# EAGLE schematic max10adc_v9.02_16chan (EAGLE 9.5.2)

## Sheet 1 of 3: Front-End
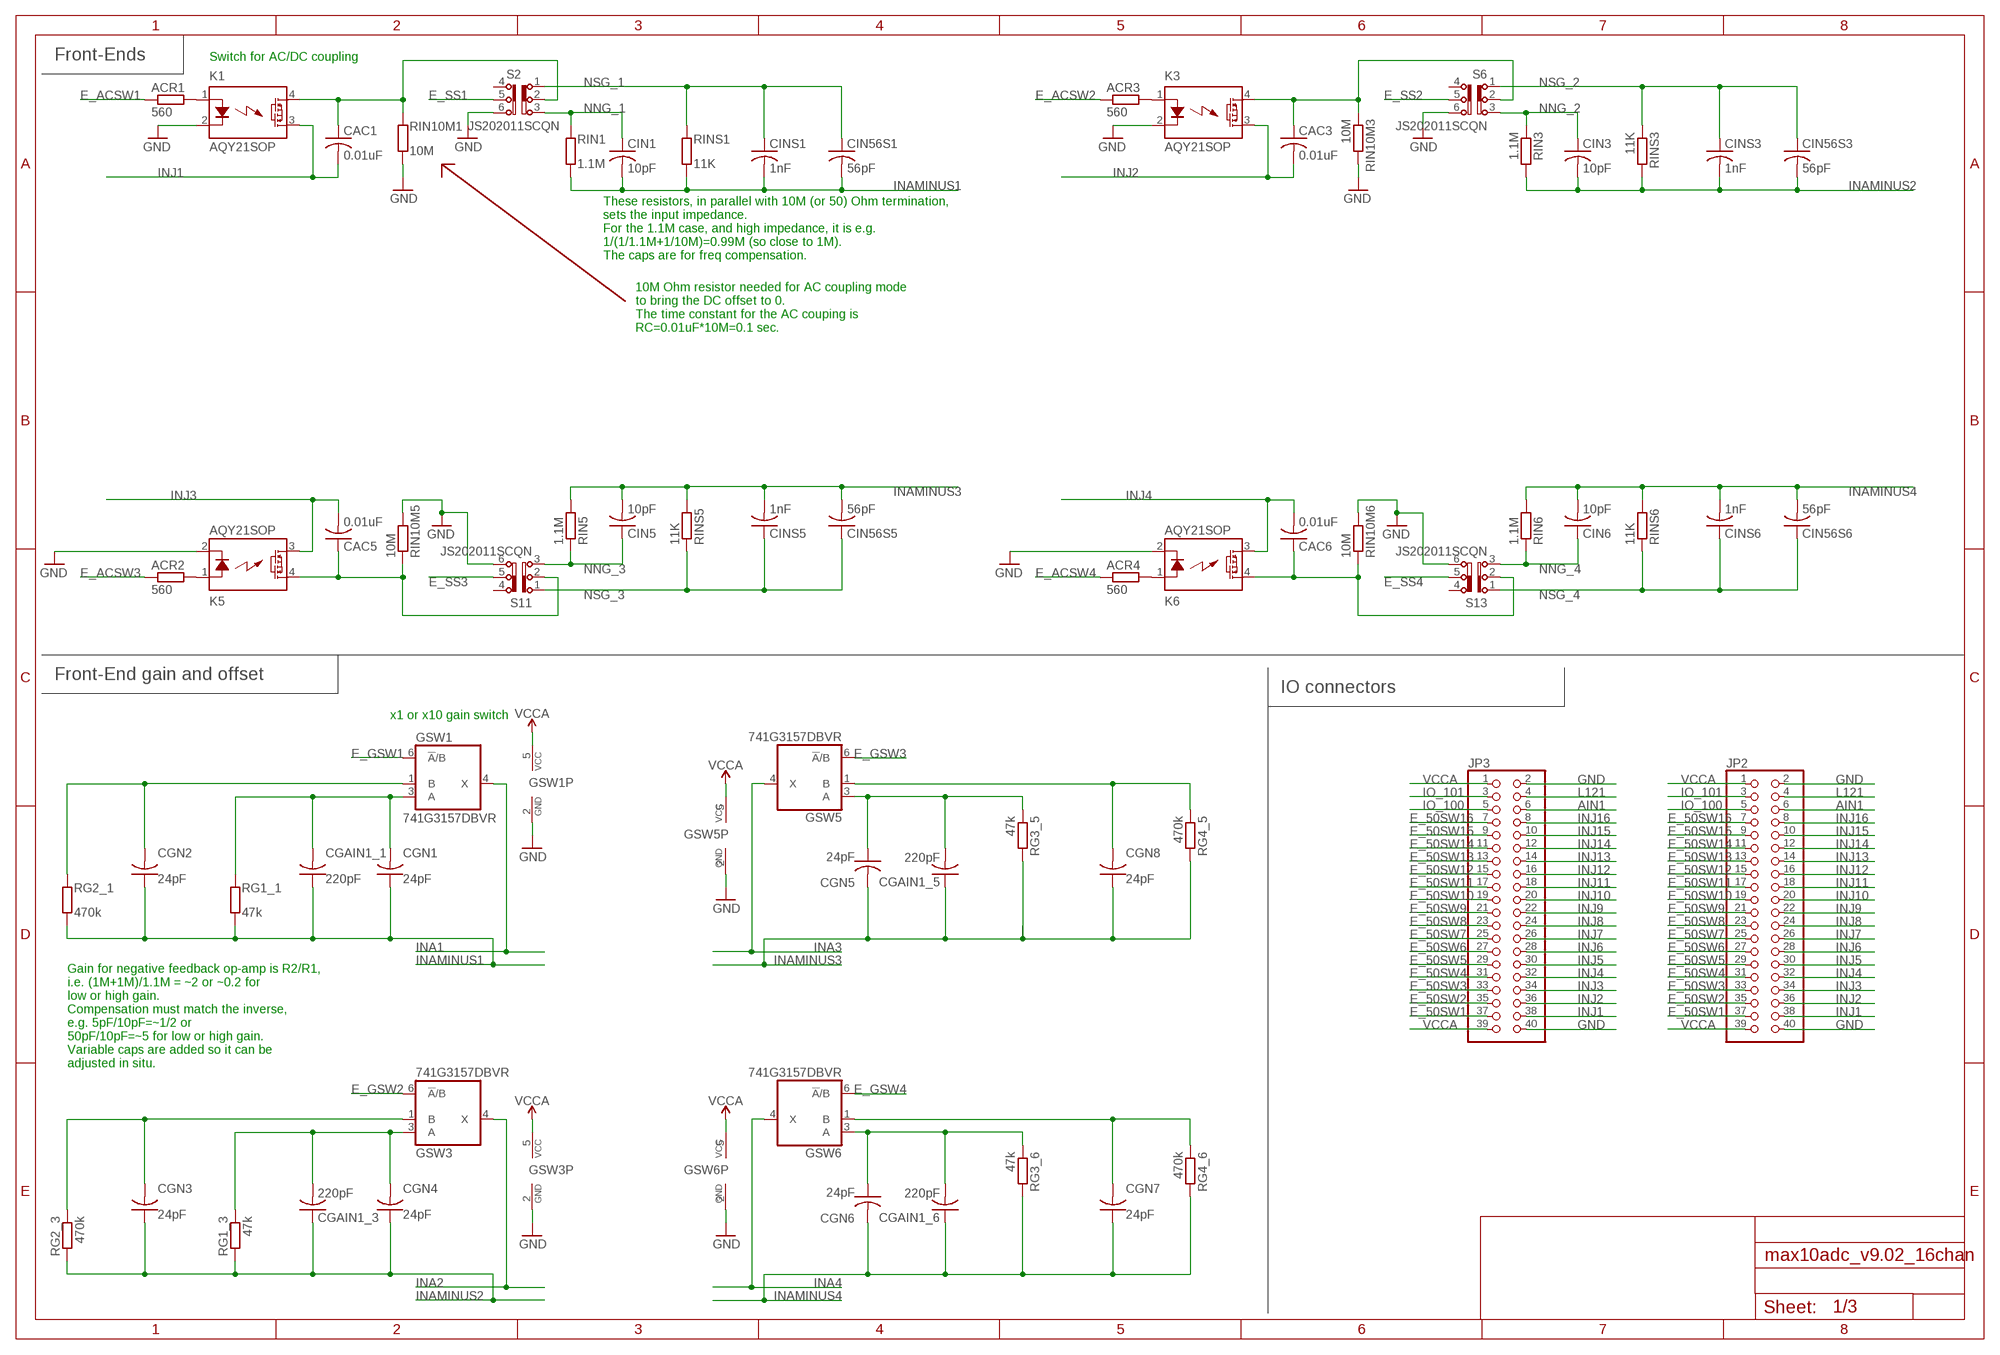
[diagram p0: schematic, sheet 1, part 1 of 3]
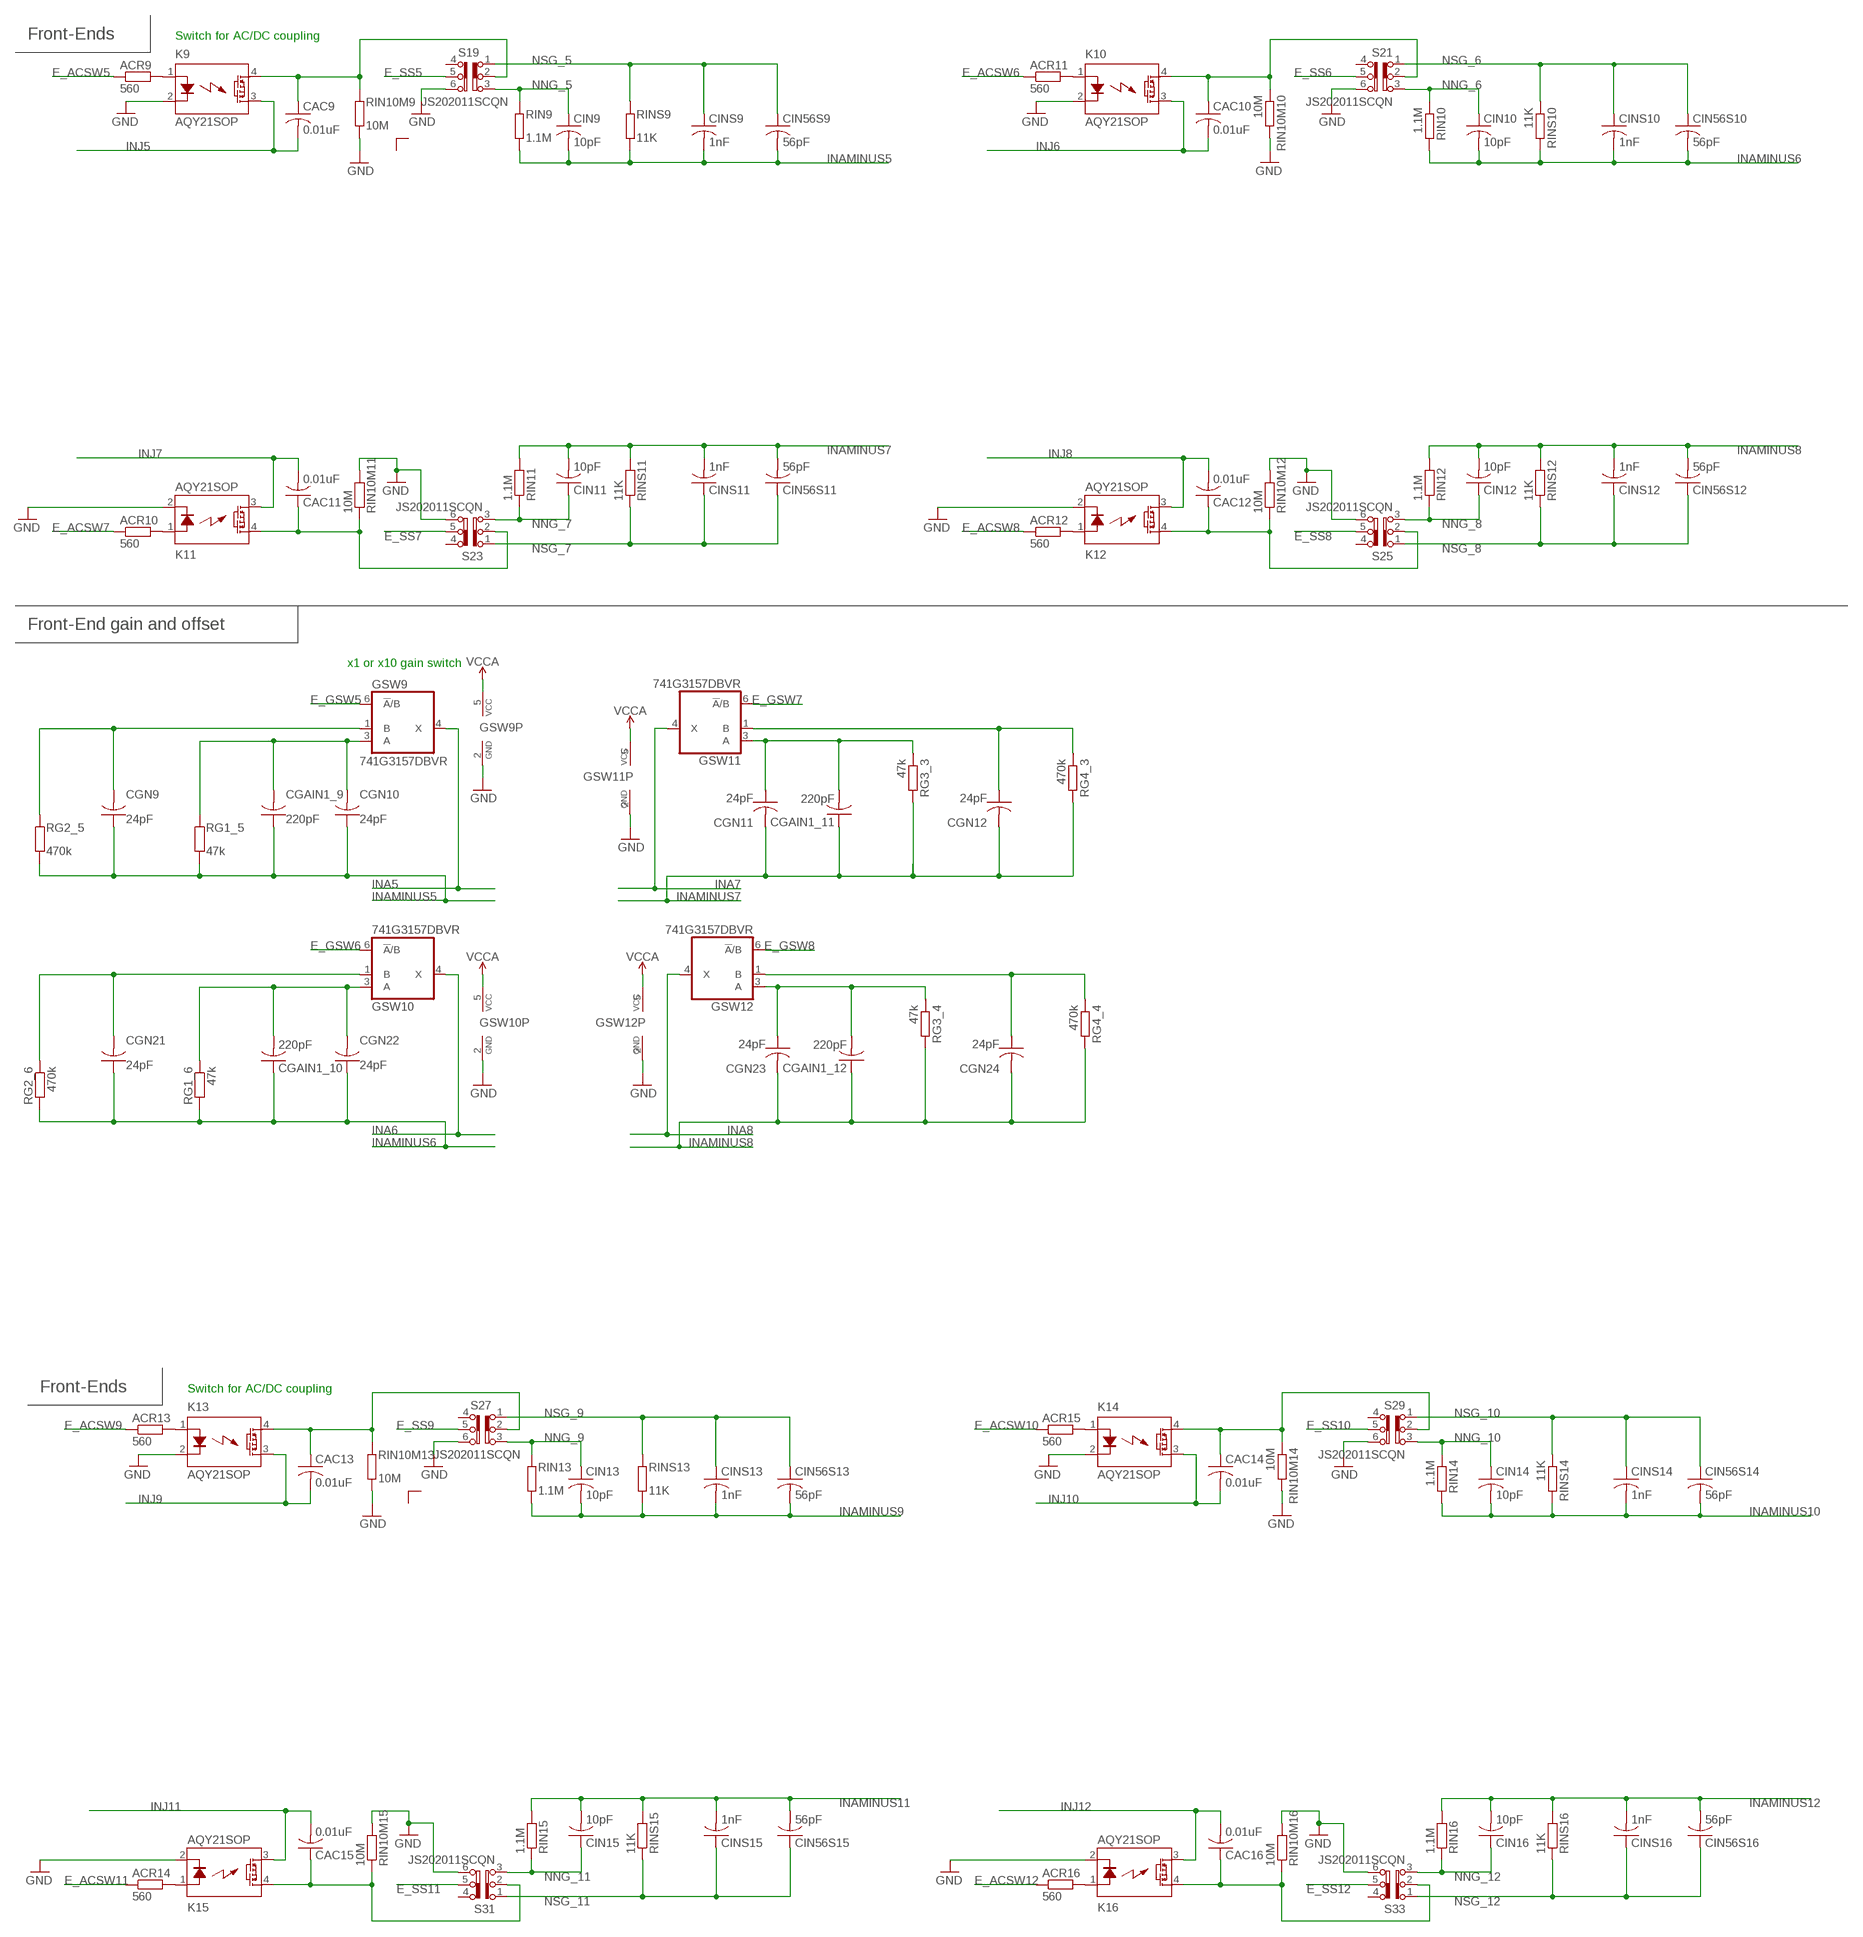
[diagram p1: schematic, sheet 1, part 2 of 3]
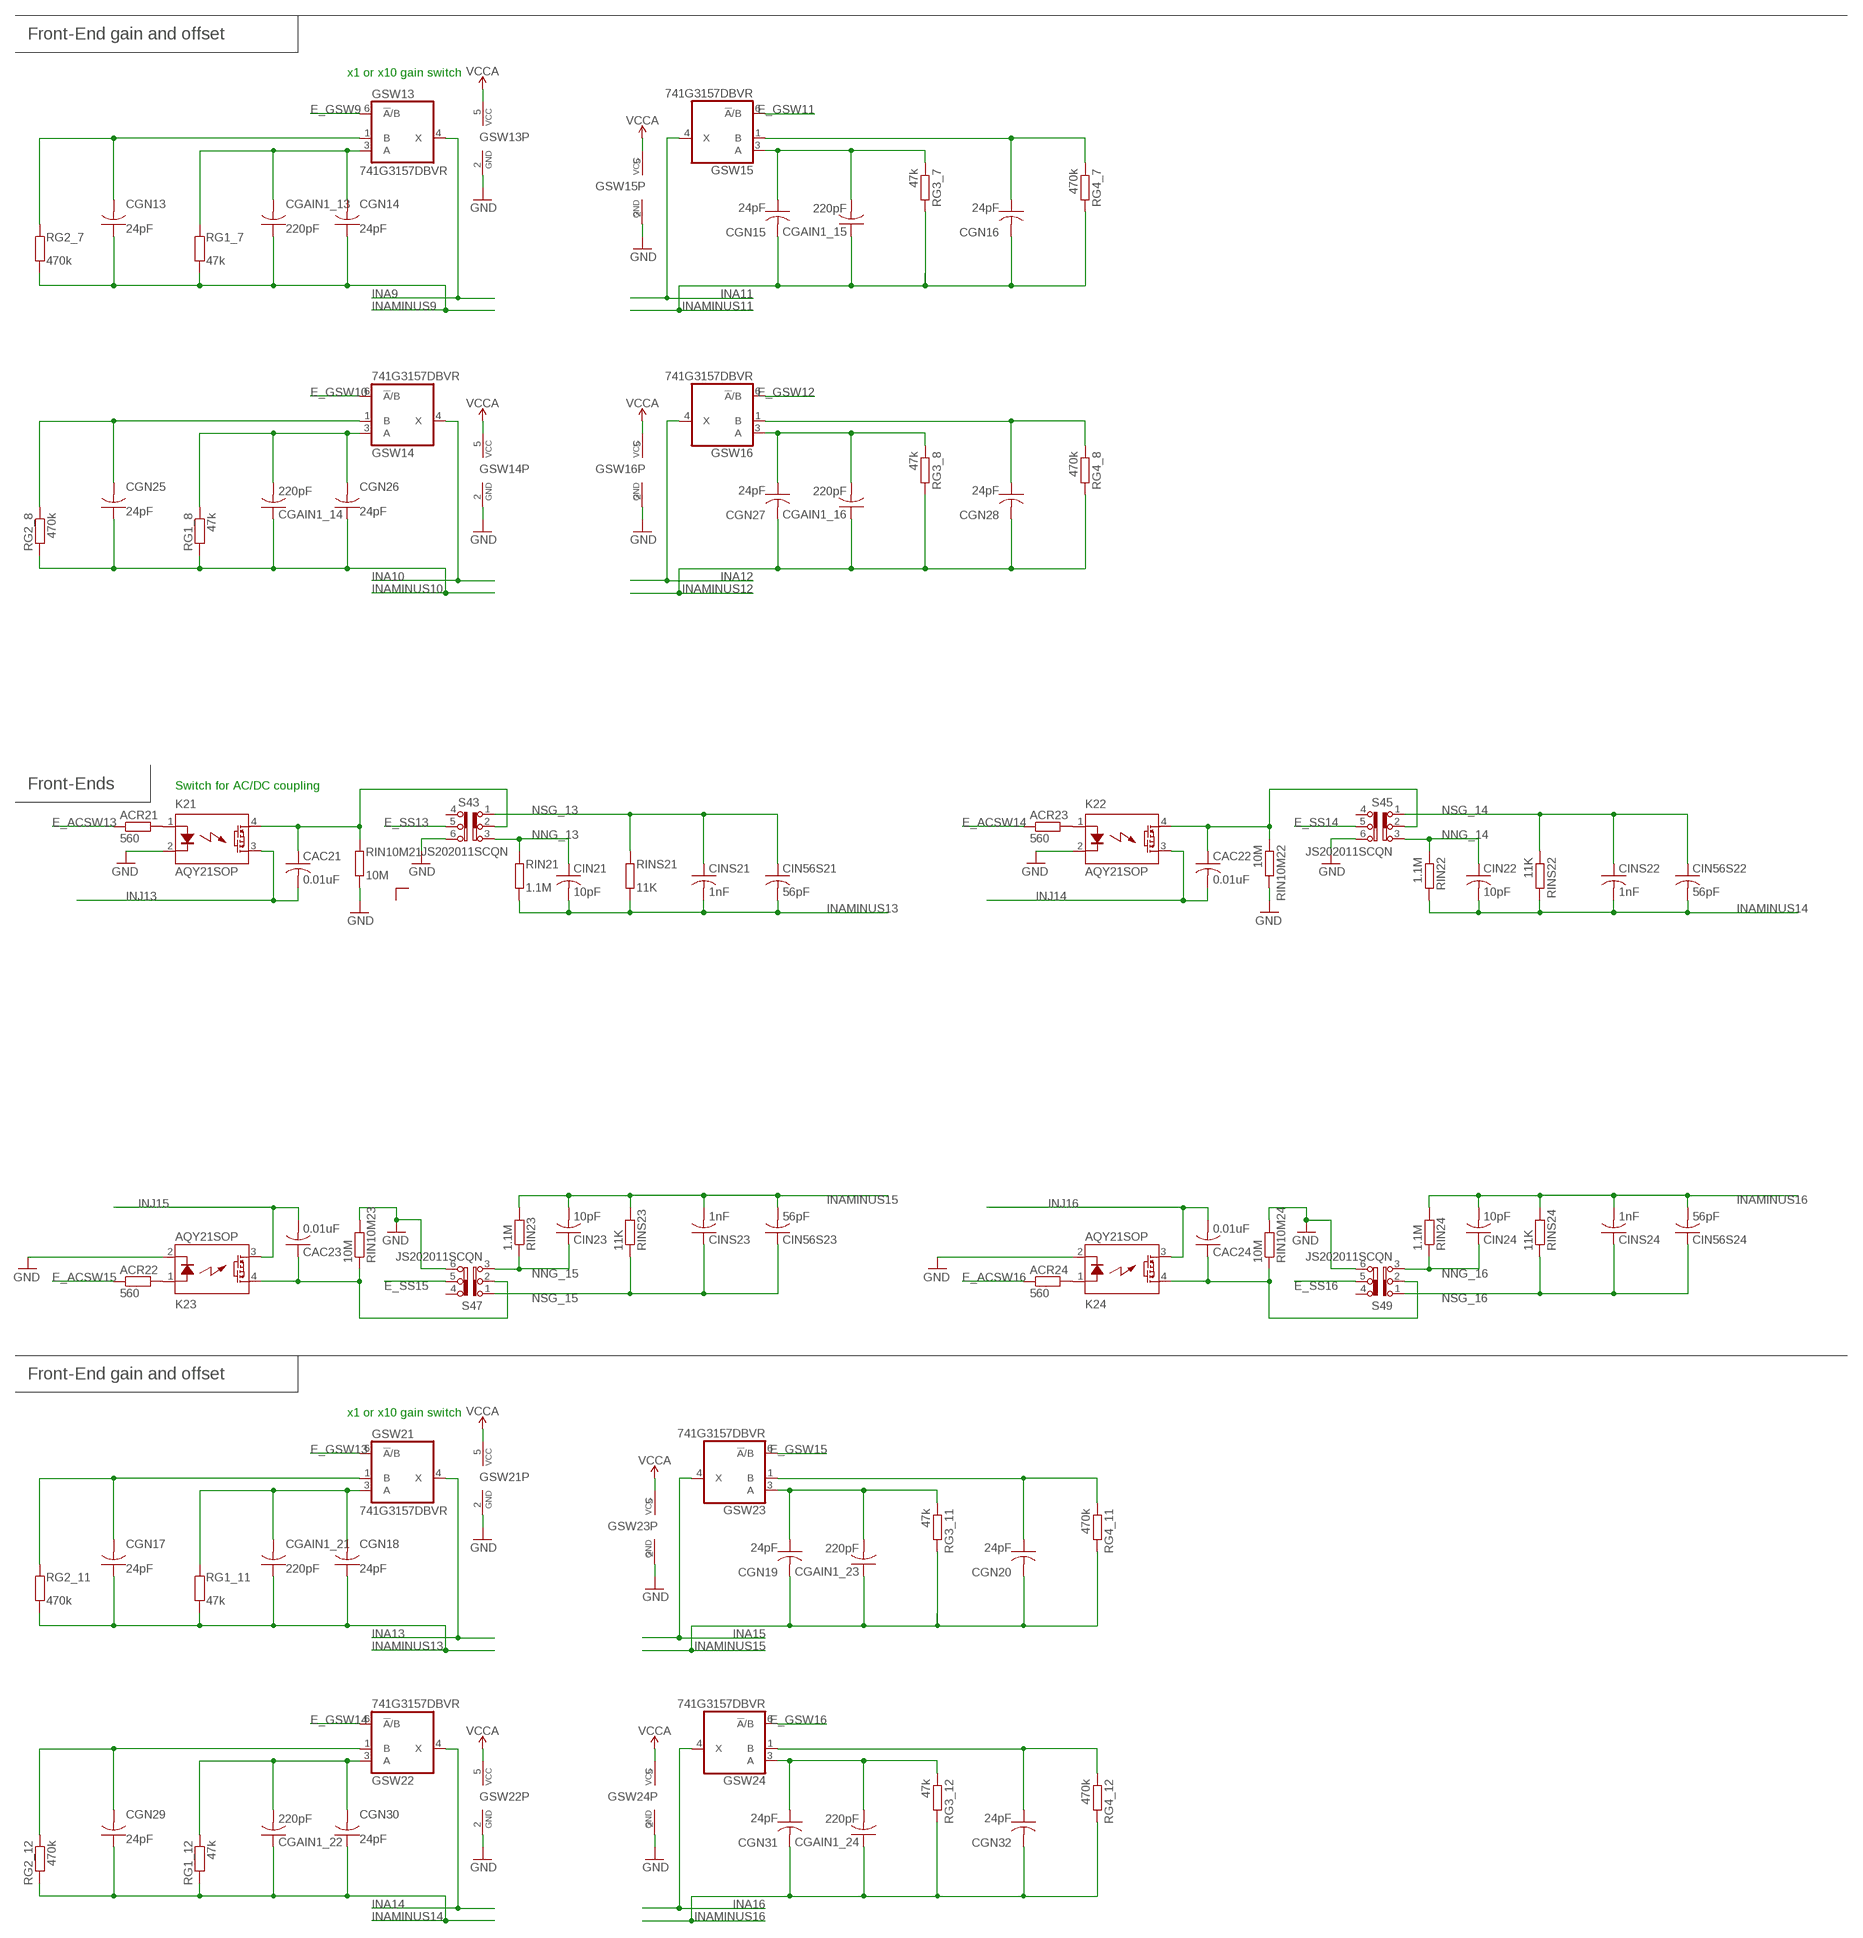
[diagram p2: schematic, sheet 1, part 3 of 3]

### Parts
ACR1  560  R-EU_R0805  [R0805]
ACR2  560  R-EU_R0805  [R0805]
ACR3  560  R-EU_R0805  [R0805]
ACR4  560  R-EU_R0805  [R0805]
ACR9  560  R-EU_R0805  [R0805]
ACR10  560  R-EU_R0805  [R0805]
ACR11  560  R-EU_R0805  [R0805]
ACR12  560  R-EU_R0805  [R0805]
ACR13  560  R-EU_R0805  [R0805]
ACR14  560  R-EU_R0805  [R0805]
ACR15  560  R-EU_R0805  [R0805]
ACR16  560  R-EU_R0805  [R0805]
ACR21  560  R-EU_R0805  [R0805]
ACR22  560  R-EU_R0805  [R0805]
ACR23  560  R-EU_R0805  [R0805]
ACR24  560  R-EU_R0805  [R0805]
CAC1  0.01uF  C-USC0603  [C0603]
CAC3  0.01uF  C-USC0603  [C0603]
CAC5  0.01uF  C-USC0603  [C0603]
CAC6  0.01uF  C-USC0603  [C0603]
CAC9  0.01uF  C-USC0603  [C0603]
CAC10  0.01uF  C-USC0603  [C0603]
CAC11  0.01uF  C-USC0603  [C0603]
CAC12  0.01uF  C-USC0603  [C0603]
CAC13  0.01uF  C-USC0603  [C0603]
CAC14  0.01uF  C-USC0603  [C0603]
CAC15  0.01uF  C-USC0603  [C0603]
CAC16  0.01uF  C-USC0603  [C0603]
CAC21  0.01uF  C-USC0603  [C0603]
CAC22  0.01uF  C-USC0603  [C0603]
CAC23  0.01uF  C-USC0603  [C0603]
CAC24  0.01uF  C-USC0603  [C0603]
CGAIN1_1  220pF  C-USC0603  [C0603]
CGAIN1_3  220pF  C-USC0603  [C0603]
CGAIN1_5  220pF  C-USC0603  [C0603]
CGAIN1_6  220pF  C-USC0603  [C0603]
CGAIN1_9  220pF  C-USC0603  [C0603]
CGAIN1_10  220pF  C-USC0603  [C0603]
CGAIN1_11  220pF  C-USC0603  [C0603]
CGAIN1_12  220pF  C-USC0603  [C0603]
CGAIN1_13  220pF  C-USC0603  [C0603]
CGAIN1_14  220pF  C-USC0603  [C0603]
CGAIN1_15  220pF  C-USC0603  [C0603]
CGAIN1_16  220pF  C-USC0603  [C0603]
CGAIN1_21  220pF  C-USC0603  [C0603]
CGAIN1_22  220pF  C-USC0603  [C0603]
CGAIN1_23  220pF  C-USC0603  [C0603]
CGAIN1_24  220pF  C-USC0603  [C0603]
CGN1  24pF  C-USC0603  [C0603]
CGN2  24pF  C-USC0603  [C0603]
CGN3  24pF  C-USC0603  [C0603]
CGN4  24pF  C-USC0603  [C0603]
CGN5  24pF  C-USC0603  [C0603]
CGN6  24pF  C-USC0603  [C0603]
CGN7  24pF  C-USC0603  [C0603]
CGN8  24pF  C-USC0603  [C0603]
CGN9  24pF  C-USC0603  [C0603]
CGN10  24pF  C-USC0603  [C0603]
CGN11  24pF  C-USC0603  [C0603]
CGN12  24pF  C-USC0603  [C0603]
CGN13  24pF  C-USC0603  [C0603]
CGN14  24pF  C-USC0603  [C0603]
CGN15  24pF  C-USC0603  [C0603]
CGN16  24pF  C-USC0603  [C0603]
CGN17  24pF  C-USC0603  [C0603]
CGN18  24pF  C-USC0603  [C0603]
CGN19  24pF  C-USC0603  [C0603]
CGN20  24pF  C-USC0603  [C0603]
CGN21  24pF  C-USC0603  [C0603]
CGN22  24pF  C-USC0603  [C0603]
CGN23  24pF  C-USC0603  [C0603]
CGN24  24pF  C-USC0603  [C0603]
CGN25  24pF  C-USC0603  [C0603]
CGN26  24pF  C-USC0603  [C0603]
CGN27  24pF  C-USC0603  [C0603]
CGN28  24pF  C-USC0603  [C0603]
CGN29  24pF  C-USC0603  [C0603]
CGN30  24pF  C-USC0603  [C0603]
CGN31  24pF  C-USC0603  [C0603]
CGN32  24pF  C-USC0603  [C0603]
CIN1  10pF  C-USC0603  [C0603]
CIN3  10pF  C-USC0603  [C0603]
CIN5  10pF  C-USC0603  [C0603]
CIN6  10pF  C-USC0603  [C0603]
CIN9  10pF  C-USC0603  [C0603]
CIN10  10pF  C-USC0603  [C0603]
CIN11  10pF  C-USC0603  [C0603]
CIN12  10pF  C-USC0603  [C0603]
CIN13  10pF  C-USC0603  [C0603]
CIN14  10pF  C-USC0603  [C0603]
CIN15  10pF  C-USC0603  [C0603]
CIN16  10pF  C-USC0603  [C0603]
CIN21  10pF  C-USC0603  [C0603]
CIN22  10pF  C-USC0603  [C0603]
CIN23  10pF  C-USC0603  [C0603]
CIN24  10pF  C-USC0603  [C0603]
CIN56S1  56pF  C-USC0603  [C0603]
CIN56S3  56pF  C-USC0603  [C0603]
CIN56S5  56pF  C-USC0603  [C0603]
CIN56S6  56pF  C-USC0603  [C0603]
CIN56S9  56pF  C-USC0603  [C0603]
CIN56S10  56pF  C-USC0603  [C0603]
CIN56S11  56pF  C-USC0603  [C0603]
CIN56S12  56pF  C-USC0603  [C0603]
CIN56S13  56pF  C-USC0603  [C0603]
CIN56S14  56pF  C-USC0603  [C0603]
CIN56S15  56pF  C-USC0603  [C0603]
CIN56S16  56pF  C-USC0603  [C0603]
CIN56S21  56pF  C-USC0603  [C0603]
CIN56S22  56pF  C-USC0603  [C0603]
CIN56S23  56pF  C-USC0603  [C0603]
CIN56S24  56pF  C-USC0603  [C0603]
CINS1  1nF  C-USC0603  [C0603]
CINS3  1nF  C-USC0603  [C0603]
CINS5  1nF  C-USC0603  [C0603]
CINS6  1nF  C-USC0603  [C0603]
CINS9  1nF  C-USC0603  [C0603]
CINS10  1nF  C-USC0603  [C0603]
CINS11  1nF  C-USC0603  [C0603]
CINS12  1nF  C-USC0603  [C0603]
CINS13  1nF  C-USC0603  [C0603]
CINS14  1nF  C-USC0603  [C0603]
CINS15  1nF  C-USC0603  [C0603]
CINS16  1nF  C-USC0603  [C0603]
CINS21  1nF  C-USC0603  [C0603]
CINS22  1nF  C-USC0603  [C0603]
CINS23  1nF  C-USC0603  [C0603]
CINS24  1nF  C-USC0603  [C0603]
GSW1  741G3157DBVR  [DBV_R-PDSO-G6]
GSW3  741G3157DBVR  [DBV_R-PDSO-G6]
GSW5  741G3157DBVR  [DBV_R-PDSO-G6]
GSW6  741G3157DBVR  [DBV_R-PDSO-G6]
GSW9  741G3157DBVR  [DBV_R-PDSO-G6]
GSW10  741G3157DBVR  [DBV_R-PDSO-G6]
GSW11  741G3157DBVR  [DBV_R-PDSO-G6]
GSW12  741G3157DBVR  [DBV_R-PDSO-G6]
GSW13  741G3157DBVR  [DBV_R-PDSO-G6]
GSW14  741G3157DBVR  [DBV_R-PDSO-G6]
GSW15  741G3157DBVR  [DBV_R-PDSO-G6]
GSW16  741G3157DBVR  [DBV_R-PDSO-G6]
GSW21  741G3157DBVR  [DBV_R-PDSO-G6]
GSW22  741G3157DBVR  [DBV_R-PDSO-G6]
GSW23  741G3157DBVR  [DBV_R-PDSO-G6]
GSW24  741G3157DBVR  [DBV_R-PDSO-G6]
JP2  PINHD-2X20/90  [2X20/90]
JP3  PINHD-2X20  [2X20]
K1  AQY21SOP  [SOP04]
K3  AQY21SOP  [SOP04]
K5  AQY21SOP  [SOP04]
K6  AQY21SOP  [SOP04]
K9  AQY21SOP  [SOP04]
K10  AQY21SOP  [SOP04]
K11  AQY21SOP  [SOP04]
K12  AQY21SOP  [SOP04]
K13  AQY21SOP  [SOP04]
K14  AQY21SOP  [SOP04]
K15  AQY21SOP  [SOP04]
K16  AQY21SOP  [SOP04]
K21  AQY21SOP  [SOP04]
K22  AQY21SOP  [SOP04]
K23  AQY21SOP  [SOP04]
K24  AQY21SOP  [SOP04]
RG1_1  47k  R-EU_R0805  [R0805]
RG1_3  47k  R-EU_R0805  [R0805]
RG1_5  47k  R-EU_R0805  [R0805]
RG1_6  47k  R-EU_R0805  [R0805]
RG1_7  47k  R-EU_R0805  [R0805]
RG1_8  47k  R-EU_R0805  [R0805]
RG1_11  47k  R-EU_R0805  [R0805]
RG1_12  47k  R-EU_R0805  [R0805]
RG2_1  470k  R-EU_R0805  [R0805]
RG2_3  470k  R-EU_R0805  [R0805]
RG2_5  470k  R-EU_R0805  [R0805]
RG2_6  470k  R-EU_R0805  [R0805]
RG2_7  470k  R-EU_R0805  [R0805]
RG2_8  470k  R-EU_R0805  [R0805]
RG2_11  470k  R-EU_R0805  [R0805]
RG2_12  470k  R-EU_R0805  [R0805]
RG3_3  47k  R-EU_R0805  [R0805]
RG3_4  47k  R-EU_R0805  [R0805]
RG3_5  47k  R-EU_R0805  [R0805]
RG3_6  47k  R-EU_R0805  [R0805]
RG3_7  47k  R-EU_R0805  [R0805]
RG3_8  47k  R-EU_R0805  [R0805]
RG3_11  47k  R-EU_R0805  [R0805]
RG3_12  47k  R-EU_R0805  [R0805]
RG4_3  470k  R-EU_R0805  [R0805]
RG4_4  470k  R-EU_R0805  [R0805]
RG4_5  470k  R-EU_R0805  [R0805]
RG4_6  470k  R-EU_R0805  [R0805]
RG4_7  470k  R-EU_R0805  [R0805]
RG4_8  470k  R-EU_R0805  [R0805]
RG4_11  470k  R-EU_R0805  [R0805]
RG4_12  470k  R-EU_R0805  [R0805]
RIN1  1.1M  R-EU_R0805  [R0805]
RIN3  1.1M  R-EU_R0805  [R0805]
RIN5  1.1M  R-EU_R0805  [R0805]
RIN6  1.1M  R-EU_R0805  [R0805]
RIN9  1.1M  R-EU_R0805  [R0805]
RIN10  1.1M  R-EU_R0805  [R0805]
RIN10M1  10M  R-EU_R0805  [R0805]
RIN10M3  10M  R-EU_R0805  [R0805]
RIN10M5  10M  R-EU_R0805  [R0805]
RIN10M6  10M  R-EU_R0805  [R0805]
RIN10M9  10M  R-EU_R0805  [R0805]
RIN10M10  10M  R-EU_R0805  [R0805]
RIN10M11  10M  R-EU_R0805  [R0805]
RIN10M12  10M  R-EU_R0805  [R0805]
RIN10M13  10M  R-EU_R0805  [R0805]
RIN10M14  10M  R-EU_R0805  [R0805]
RIN10M15  10M  R-EU_R0805  [R0805]
RIN10M16  10M  R-EU_R0805  [R0805]
RIN10M21  10M  R-EU_R0805  [R0805]
RIN10M22  10M  R-EU_R0805  [R0805]
RIN10M23  10M  R-EU_R0805  [R0805]
RIN10M24  10M  R-EU_R0805  [R0805]
RIN11  1.1M  R-EU_R0805  [R0805]
RIN12  1.1M  R-EU_R0805  [R0805]
RIN13  1.1M  R-EU_R0805  [R0805]
RIN14  1.1M  R-EU_R0805  [R0805]
RIN15  1.1M  R-EU_R0805  [R0805]
RIN16  1.1M  R-EU_R0805  [R0805]
RIN21  1.1M  R-EU_R0805  [R0805]
RIN22  1.1M  R-EU_R0805  [R0805]
RIN23  1.1M  R-EU_R0805  [R0805]
RIN24  1.1M  R-EU_R0805  [R0805]
RINS1  11K  R-EU_R0805  [R0805]
RINS3  11K  R-EU_R0805  [R0805]
RINS5  11K  R-EU_R0805  [R0805]
RINS6  11K  R-EU_R0805  [R0805]
RINS9  11K  R-EU_R0805  [R0805]
RINS10  11K  R-EU_R0805  [R0805]
RINS11  11K  R-EU_R0805  [R0805]
RINS12  11K  R-EU_R0805  [R0805]
RINS13  11K  R-EU_R0805  [R0805]
RINS14  11K  R-EU_R0805  [R0805]
RINS15  11K  R-EU_R0805  [R0805]
RINS16  11K  R-EU_R0805  [R0805]
RINS21  11K  R-EU_R0805  [R0805]
RINS22  11K  R-EU_R0805  [R0805]
RINS23  11K  R-EU_R0805  [R0805]
RINS24  11K  R-EU_R0805  [R0805]
S2  JS202011SCQN  [JS202011SCQN]
S6  JS202011SCQN  [JS202011SCQN]
S11  JS202011SCQN  [JS202011SCQN]
S13  JS202011SCQN  [JS202011SCQN]
S19  JS202011SCQN  [JS202011SCQN]
S21  JS202011SCQN  [JS202011SCQN]
S23  JS202011SCQN  [JS202011SCQN]
S25  JS202011SCQN  [JS202011SCQN]
S27  JS202011SCQN  [JS202011SCQN]
S29  JS202011SCQN  [JS202011SCQN]
S31  JS202011SCQN  [JS202011SCQN]
S33  JS202011SCQN  [JS202011SCQN]
S43  JS202011SCQN  [JS202011SCQN]
S45  JS202011SCQN  [JS202011SCQN]
S47  JS202011SCQN  [JS202011SCQN]
S49  JS202011SCQN  [JS202011SCQN]

### Nets
AIN1: JP2.6 JP3.6 ; also sheet 2
CGAIN1: CGAIN1_1.2 CGN1.2 GSW1.3(A) RG1_1.1
CGAIN2: CGN2.2 GSW1.1(B) RG2_1.1
CGAIN5: CGAIN1_3.2 CGN4.2 GSW3.3(A) RG1_3.1
CGAIN6: CGN3.2 GSW3.1(B) RG2_3.1
CGAIN9: CGAIN1_5.2 CGN5.1 GSW5.3(A) RG3_5.1
CGAIN10: CGN8.2 GSW5.1(B) RG4_5.1
CGAIN11: CGAIN1_6.2 CGN6.1 GSW6.3(A) RG3_6.1
CGAIN12: CGN7.2 GSW6.1(B) RG4_6.1
CGAIN17: CGAIN1_9.2 CGN10.2 GSW9.3(A) RG1_5.1
CGAIN18: CGN9.2 GSW9.1(B) RG2_5.1
CGAIN19: CGAIN1_10.2 CGN22.2 GSW10.3(A) RG1_6.1
CGAIN20: CGN21.2 GSW10.1(B) RG2_6.1
CGAIN21: CGAIN1_11.2 CGN11.1 GSW11.3(A) RG3_3.1
CGAIN22: CGN12.1 GSW11.1(B) RG4_3.1
CGAIN23: CGAIN1_12.2 CGN23.1 GSW12.3(A) RG3_4.1
CGAIN24: CGN24.1 GSW12.1(B) RG4_4.1
CGAIN25: CGAIN1_13.2 CGN14.2 GSW13.3(A) RG1_7.1
CGAIN26: CGN13.2 GSW13.1(B) RG2_7.1
CGAIN27: CGAIN1_14.2 CGN26.2 GSW14.3(A) RG1_8.1
CGAIN28: CGN25.2 GSW14.1(B) RG2_8.1
CGAIN29: CGAIN1_15.2 CGN15.1 GSW15.3(A) RG3_7.1
CGAIN30: CGN16.1 GSW15.1(B) RG4_7.1
CGAIN31: CGAIN1_16.2 CGN27.1 GSW16.3(A) RG3_8.1
CGAIN32: CGN28.1 GSW16.1(B) RG4_8.1
CGAIN41: CGAIN1_21.2 CGN18.2 GSW21.3(A) RG1_11.1
CGAIN42: CGN17.2 GSW21.1(B) RG2_11.1
CGAIN43: CGAIN1_22.2 CGN30.2 GSW22.3(A) RG1_12.1
CGAIN44: CGN29.2 GSW22.1(B) RG2_12.1
CGAIN45: CGAIN1_23.2 CGN19.1 GSW23.3(A) RG3_11.1
CGAIN46: CGN20.1 GSW23.1(B) RG4_11.1
CGAIN47: CGAIN1_24.2 CGN31.1 GSW24.3(A) RG3_12.1
CGAIN48: CGN32.1 GSW24.1(B) RG4_12.1
E_50SW1: JP2.37 JP3.37 ; also sheet 2
E_50SW2: JP2.35 JP3.35 ; also sheet 2
E_50SW3: JP2.33 JP3.33 ; also sheet 2
E_50SW4: JP2.31 JP3.31 ; also sheet 2
E_50SW5: JP2.29 JP3.29 ; also sheet 2
E_50SW6: JP2.27 JP3.27 ; also sheet 2
E_50SW7: JP2.25 JP3.25 ; also sheet 2
E_50SW8: JP2.23 JP3.23 ; also sheet 2
E_50SW9: JP2.21 JP3.21 ; also sheet 2
E_50SW10: JP2.19 JP3.19 ; also sheet 2
E_50SW11: JP2.17 JP3.17 ; also sheet 2
E_50SW12: JP2.15 JP3.15 ; also sheet 2
E_50SW13: JP2.13 JP3.13 ; also sheet 2
E_50SW14: JP2.11 JP3.11 ; also sheet 2
E_50SW15: JP2.9 JP3.9 ; also sheet 2
E_50SW16: JP2.7 JP3.7 ; also sheet 2
E_ACSW1: ACR1.1 ; also sheet 2
E_ACSW2: ACR3.1 ; also sheet 2
E_ACSW3: ACR2.1 ; also sheet 2
E_ACSW4: ACR4.1 ; also sheet 2
E_ACSW5: ACR9.1 ; also sheet 2
E_ACSW6: ACR11.1 ; also sheet 2
E_ACSW7: ACR10.1 ; also sheet 2
E_ACSW8: ACR12.1 ; also sheet 2
E_ACSW9: ACR13.1 ; also sheet 2
E_ACSW10: ACR15.1 ; also sheet 2
E_ACSW11: ACR14.1 ; also sheet 2
E_ACSW12: ACR16.1 ; also sheet 2
E_ACSW13: ACR21.1 ; also sheet 2
E_ACSW14: ACR23.1 ; also sheet 2
E_ACSW15: ACR22.1 ; also sheet 2
E_ACSW16: ACR24.1 ; also sheet 2
E_GSW1: GSW1.6(!A!/B) ; also sheet 2
E_GSW2: GSW3.6(!A!/B) ; also sheet 2
E_GSW3: GSW5.6(!A!/B) ; also sheet 2
E_GSW4: GSW6.6(!A!/B) ; also sheet 2
E_GSW5: GSW9.6(!A!/B) ; also sheet 2
E_GSW6: GSW10.6(!A!/B) ; also sheet 2
E_GSW7: GSW11.6(!A!/B) ; also sheet 2
E_GSW8: GSW12.6(!A!/B) ; also sheet 2
E_GSW9: GSW13.6(!A!/B) ; also sheet 2
E_GSW10: GSW14.6(!A!/B) ; also sheet 2
E_GSW11: GSW15.6(!A!/B) ; also sheet 2
E_GSW12: GSW16.6(!A!/B) ; also sheet 2
E_GSW13: GSW21.6(!A!/B) ; also sheet 2
E_GSW14: GSW22.6(!A!/B) ; also sheet 2
E_GSW15: GSW23.6(!A!/B) ; also sheet 2
E_GSW16: GSW24.6(!A!/B) ; also sheet 2
E_SS1: S2.5 ; also sheet 2
E_SS2: S6.5 ; also sheet 2
E_SS3: S11.5 ; also sheet 2
E_SS4: S13.5 ; also sheet 2
E_SS5: S19.5 ; also sheet 2
E_SS6: S21.5 ; also sheet 2
E_SS7: S23.5 ; also sheet 2
E_SS8: S25.5 ; also sheet 2
E_SS9: S27.5 ; also sheet 2
E_SS10: S29.5 ; also sheet 2
E_SS11: S31.5 ; also sheet 2
E_SS12: S33.5 ; also sheet 2
E_SS13: S43.5 ; also sheet 2
E_SS14: S45.5 ; also sheet 2
E_SS15: S47.5 ; also sheet 2
E_SS16: S49.5 ; also sheet 2
GND [gnd]: GSW1.2(GND) GSW3.2(GND) GSW5.2(GND) GSW6.2(GND) GSW9.2(GND) GSW10.2(GND) GSW11.2(GND) GSW12.2(GND) GSW13.2(GND) GSW14.2(GND) GSW15.2(GND) GSW16.2(GND) GSW21.2(GND) GSW22.2(GND) GSW23.2(GND) GSW24.2(GND) JP2.2 JP2.40 JP3.2 JP3.40 K1.2(K) K3.2(K) K5.2(K) K6.2(K) K9.2(K) K10.2(K) K11.2(K) K12.2(K) K13.2(K) K14.2(K) K15.2(K) K16.2(K) K21.2(K) K22.2(K) K23.2(K) K24.2(K) RIN10M1.2 RIN10M3.2 RIN10M5.2 RIN10M6.2 RIN10M9.2 RIN10M10.2 RIN10M11.2 RIN10M12.2 RIN10M13.2 RIN10M14.2 RIN10M15.2 RIN10M16.2 RIN10M21.2 RIN10M22.2 RIN10M23.2 RIN10M24.2 S2.6 S6.6 S11.6 S13.6 S19.6 S21.6 S23.6 S25.6 S27.6 S29.6 S31.6 S33.6 S43.6 S45.6 S47.6 S49.6 ; also sheet 2,3
INA1: GSW1.4(X) ; also sheet 3
INA2: GSW3.4(X) ; also sheet 3
INA3: GSW5.4(X) ; also sheet 3
INA4: GSW6.4(X) ; also sheet 3
INA5: GSW9.4(X) ; also sheet 3
INA6: GSW10.4(X) ; also sheet 3
INA7: GSW11.4(X) ; also sheet 3
INA8: GSW12.4(X) ; also sheet 3
INA9: GSW13.4(X) ; also sheet 3
INA10: GSW14.4(X) ; also sheet 3
INA11: GSW15.4(X) ; also sheet 3
INA12: GSW16.4(X) ; also sheet 3
INA13: GSW21.4(X) ; also sheet 3
INA14: GSW22.4(X) ; also sheet 3
INA15: GSW23.4(X) ; also sheet 3
INA16: GSW24.4(X) ; also sheet 3
INAMINUS1: CGAIN1_1.1 CGN1.1 CGN2.1 CIN1.2 CIN56S1.2 CINS1.2 RG1_1.2 RG2_1.2 RIN1.2 RINS1.2 ; also sheet 3
INAMINUS2: CGAIN1_3.1 CGN3.1 CGN4.1 CIN3.2 CIN56S3.2 CINS3.2 RG1_3.2 RG2_3.2 RIN3.2 RINS3.2 ; also sheet 3
INAMINUS3: CGAIN1_5.1 CGN5.2 CGN8.1 CIN5.2 CIN56S5.2 CINS5.2 RG3_5.2 RG4_5.2 RIN5.2 RINS5.2 ; also sheet 3
INAMINUS4: CGAIN1_6.1 CGN6.2 CGN7.1 CIN6.2 CIN56S6.2 CINS6.2 RG3_6.2 RG4_6.2 RIN6.2 RINS6.2 ; also sheet 3
INAMINUS5: CGAIN1_9.1 CGN9.1 CGN10.1 CIN9.2 CIN56S9.2 CINS9.2 RG1_5.2 RG2_5.2 RIN9.2 RINS9.2 ; also sheet 3
INAMINUS6: CGAIN1_10.1 CGN21.1 CGN22.1 CIN10.2 CIN56S10.2 CINS10.2 RG1_6.2 RG2_6.2 RIN10.2 RINS10.2 ; also sheet 3
INAMINUS7: CGAIN1_11.1 CGN11.2 CGN12.2 CIN11.2 CIN56S11.2 CINS11.2 RG3_3.2 RG4_3.2 RIN11.2 RINS11.2 ; also sheet 3
INAMINUS8: CGAIN1_12.1 CGN23.2 CGN24.2 CIN12.2 CIN56S12.2 CINS12.2 RG3_4.2 RG4_4.2 RIN12.2 RINS12.2 ; also sheet 3
INAMINUS9: CGAIN1_13.1 CGN13.1 CGN14.1 CIN13.2 CIN56S13.2 CINS13.2 RG1_7.2 RG2_7.2 RIN13.2 RINS13.2 ; also sheet 3
INAMINUS10: CGAIN1_14.1 CGN25.1 CGN26.1 CIN14.2 CIN56S14.2 CINS14.2 RG1_8.2 RG2_8.2 RIN14.2 RINS14.2 ; also sheet 3
INAMINUS11: CGAIN1_15.1 CGN15.2 CGN16.2 CIN15.2 CIN56S15.2 CINS15.2 RG3_7.2 RG4_7.2 RIN15.2 RINS15.2 ; also sheet 3
INAMINUS12: CGAIN1_16.1 CGN27.2 CGN28.2 CIN16.2 CIN56S16.2 CINS16.2 RG3_8.2 RG4_8.2 RIN16.2 RINS16.2 ; also sheet 3
INAMINUS13: CGAIN1_21.1 CGN17.1 CGN18.1 CIN21.2 CIN56S21.2 CINS21.2 RG1_11.2 RG2_11.2 RIN21.2 RINS21.2 ; also sheet 3
INAMINUS14: CGAIN1_22.1 CGN29.1 CGN30.1 CIN22.2 CIN56S22.2 CINS22.2 RG1_12.2 RG2_12.2 RIN22.2 RINS22.2 ; also sheet 3
INAMINUS15: CGAIN1_23.1 CGN19.2 CGN20.2 CIN23.2 CIN56S23.2 CINS23.2 RG3_11.2 RG4_11.2 RIN23.2 RINS23.2 ; also sheet 3
INAMINUS16: CGAIN1_24.1 CGN31.2 CGN32.2 CIN24.2 CIN56S24.2 CINS24.2 RG3_12.2 RG4_12.2 RIN24.2 RINS24.2 ; also sheet 3
INJ1: CAC1.2 JP2.38 JP3.38 K1.3(DS2)
INJ2: CAC3.2 JP2.36 JP3.36 K3.3(DS2)
INJ3: CAC5.2 JP2.34 JP3.34 K5.3(DS2)
INJ4: CAC6.2 JP2.32 JP3.32 K6.3(DS2)
INJ5: CAC9.2 JP2.30 JP3.30 K9.3(DS2)
INJ6: CAC10.2 JP2.28 JP3.28 K10.3(DS2)
INJ7: CAC11.2 JP2.26 JP3.26 K11.3(DS2)
INJ8: CAC12.2 JP2.24 JP3.24 K12.3(DS2)
INJ9: CAC13.2 JP2.22 JP3.22 K13.3(DS2)
INJ10: CAC14.2 JP2.20 JP3.20 K14.3(DS2)
INJ11: CAC15.2 JP2.18 JP3.18 K15.3(DS2)
INJ12: CAC16.2 JP2.16 JP3.16 K16.3(DS2)
INJ13: CAC21.2 JP2.14 JP3.14 K21.3(DS2)
INJ14: CAC22.2 JP2.12 JP3.12 K22.3(DS2)
INJ15: CAC23.2 JP2.10 JP3.10 K23.3(DS2)
INJ16: CAC24.2 JP2.8 JP3.8 K24.3(DS2)
IO_100: JP2.5 JP3.5 ; also sheet 2
IO_101: JP2.3 JP3.3 ; also sheet 2
L121: JP2.4 JP3.4 ; also sheet 2
N$2: ACR11.2 K10.1(A)
N$3: ACR10.2 K11.1(A)
N$4: ACR2.2 K5.1(A)
N$5: ACR3.2 K3.1(A)
N$6: ACR4.2 K6.1(A)
N$7: ACR12.2 K12.1(A)
N$8: ACR13.2 K13.1(A)
N$9: CAC3.1 K3.4(DS1) RIN10M3.1 S6.2
N$10: CAC1.1 K1.4(DS1) RIN10M1.1 S2.2
N$11: ACR1.2 K1.1(A)
N$24: CAC5.1 K5.4(DS1) RIN10M5.1 S11.2
N$27: CAC6.1 K6.4(DS1) RIN10M6.1 S13.2
N$28: CAC9.1 K9.4(DS1) RIN10M9.1 S19.2
N$29: CAC10.1 K10.4(DS1) RIN10M10.1 S21.2
N$30: CAC11.1 K11.4(DS1) RIN10M11.1 S23.2
N$32: CAC12.1 K12.4(DS1) RIN10M12.1 S25.2
N$37: ACR15.2 K14.1(A)
N$38: ACR14.2 K15.1(A)
N$39: ACR16.2 K16.1(A)
N$40: ACR21.2 K21.1(A)
N$52: CAC13.1 K13.4(DS1) RIN10M13.1 S27.2
N$53: CAC14.1 K14.4(DS1) RIN10M14.1 S29.2
N$54: CAC15.1 K15.4(DS1) RIN10M15.1 S31.2
N$55: CAC16.1 K16.4(DS1) RIN10M16.1 S33.2
N$59: ACR23.2 K22.1(A)
N$60: ACR22.2 K23.1(A)
N$61: ACR24.2 K24.1(A)
N$62: ACR9.2 K9.1(A)
N$68: CAC21.1 K21.4(DS1) RIN10M21.1 S43.2
N$69: CAC22.1 K22.4(DS1) RIN10M22.1 S45.2
N$70: CAC23.1 K23.4(DS1) RIN10M23.1 S47.2
N$71: CAC24.1 K24.4(DS1) RIN10M24.1 S49.2
NNG_1: CIN1.1 RIN1.1 S2.3
NNG_2: CIN3.1 RIN3.1 S6.3
NNG_3: CIN5.1 RIN5.1 S11.3
NNG_4: CIN6.1 RIN6.1 S13.3
NNG_5: CIN9.1 RIN9.1 S19.3
NNG_6: CIN10.1 RIN10.1 S21.3
NNG_7: CIN11.1 RIN11.1 S23.3
NNG_8: CIN12.1 RIN12.1 S25.3
NNG_9: CIN13.1 RIN13.1 S27.3
NNG_10: CIN14.1 RIN14.1 S29.3
NNG_11: CIN15.1 RIN15.1 S31.3
NNG_12: CIN16.1 RIN16.1 S33.3
NNG_13: CIN21.1 RIN21.1 S43.3
NNG_14: CIN22.1 RIN22.1 S45.3
NNG_15: CIN23.1 RIN23.1 S47.3
NNG_16: CIN24.1 RIN24.1 S49.3
NSG_1: CIN56S1.1 CINS1.1 RINS1.1 S2.1
NSG_2: CIN56S3.1 CINS3.1 RINS3.1 S6.1
NSG_3: CIN56S5.1 CINS5.1 RINS5.1 S11.1
NSG_4: CIN56S6.1 CINS6.1 RINS6.1 S13.1
NSG_5: CIN56S9.1 CINS9.1 RINS9.1 S19.1
NSG_6: CIN56S10.1 CINS10.1 RINS10.1 S21.1
NSG_7: CIN56S11.1 CINS11.1 RINS11.1 S23.1
NSG_8: CIN56S12.1 CINS12.1 RINS12.1 S25.1
NSG_9: CIN56S13.1 CINS13.1 RINS13.1 S27.1
NSG_10: CIN56S14.1 CINS14.1 RINS14.1 S29.1
NSG_11: CIN56S15.1 CINS15.1 RINS15.1 S31.1
NSG_12: CIN56S16.1 CINS16.1 RINS16.1 S33.1
NSG_13: CIN56S21.1 CINS21.1 RINS21.1 S43.1
NSG_14: CIN56S22.1 CINS22.1 RINS22.1 S45.1
NSG_15: CIN56S23.1 CINS23.1 RINS23.1 S47.1
NSG_16: CIN56S24.1 CINS24.1 RINS24.1 S49.1
VCCA [three]: GSW1.5(VCC) GSW3.5(VCC) GSW5.5(VCC) GSW6.5(VCC) GSW9.5(VCC) GSW10.5(VCC) GSW11.5(VCC) GSW12.5(VCC) GSW13.5(VCC) GSW14.5(VCC) GSW15.5(VCC) GSW16.5(VCC) GSW21.5(VCC) GSW22.5(VCC) GSW23.5(VCC) GSW24.5(VCC) JP2.1 JP2.39 JP3.1 JP3.39 ; also sheet 3
Unconnected: S2.4 S6.4 S11.4 S13.4 S19.4 S21.4 S23.4 S25.4 S27.4 S29.4 S31.4 S33.4 S43.4 S45.4 S47.4 S49.4

### Notes on the sheet
- Front-Ends | Switch for AC/DC coupling | Front-Ends | Switch for AC/DC coupling
- These resistors, in parallel with 10M (or 50) Ohm termination, 
  sets the input impedance.
  For the 1.1M case, and high impedance, it is e.g. 
  1/(1/1.1M+1/10M)=0.99M (so close to 1M).
  The caps are for freq compensation.
- 10M Ohm resistor needed for AC coupling mode
  to bring the DC offset to 0.
  The time constant for the AC couping is
  RC=0.01uF*10M=0.1 sec.
- Front-End gain and offset | Front-End gain and offset
- IO connectors
- x1 or x10 gain switch | x1 or x10 gain switch
- Gain for negative feedback op-amp is R2/R1,
  i.e. (1M+1M)/1.1M = ~2 or ~0.2 for 
  low or high gain.
  Compensation must match the inverse, 
  e.g. 5pF/10pF=~1/2 or 
  50pF/10pF=~5 for low or high gain.
  Variable caps are added so it can be
  adjusted in situ.
- Front-Ends | Switch for AC/DC coupling
- Front-End gain and offset
- x1 or x10 gain switch
- Front-Ends | Switch for AC/DC coupling
- Front-End gain and offset
- x1 or x10 gain switch

## Sheet 2 of 3: Digital
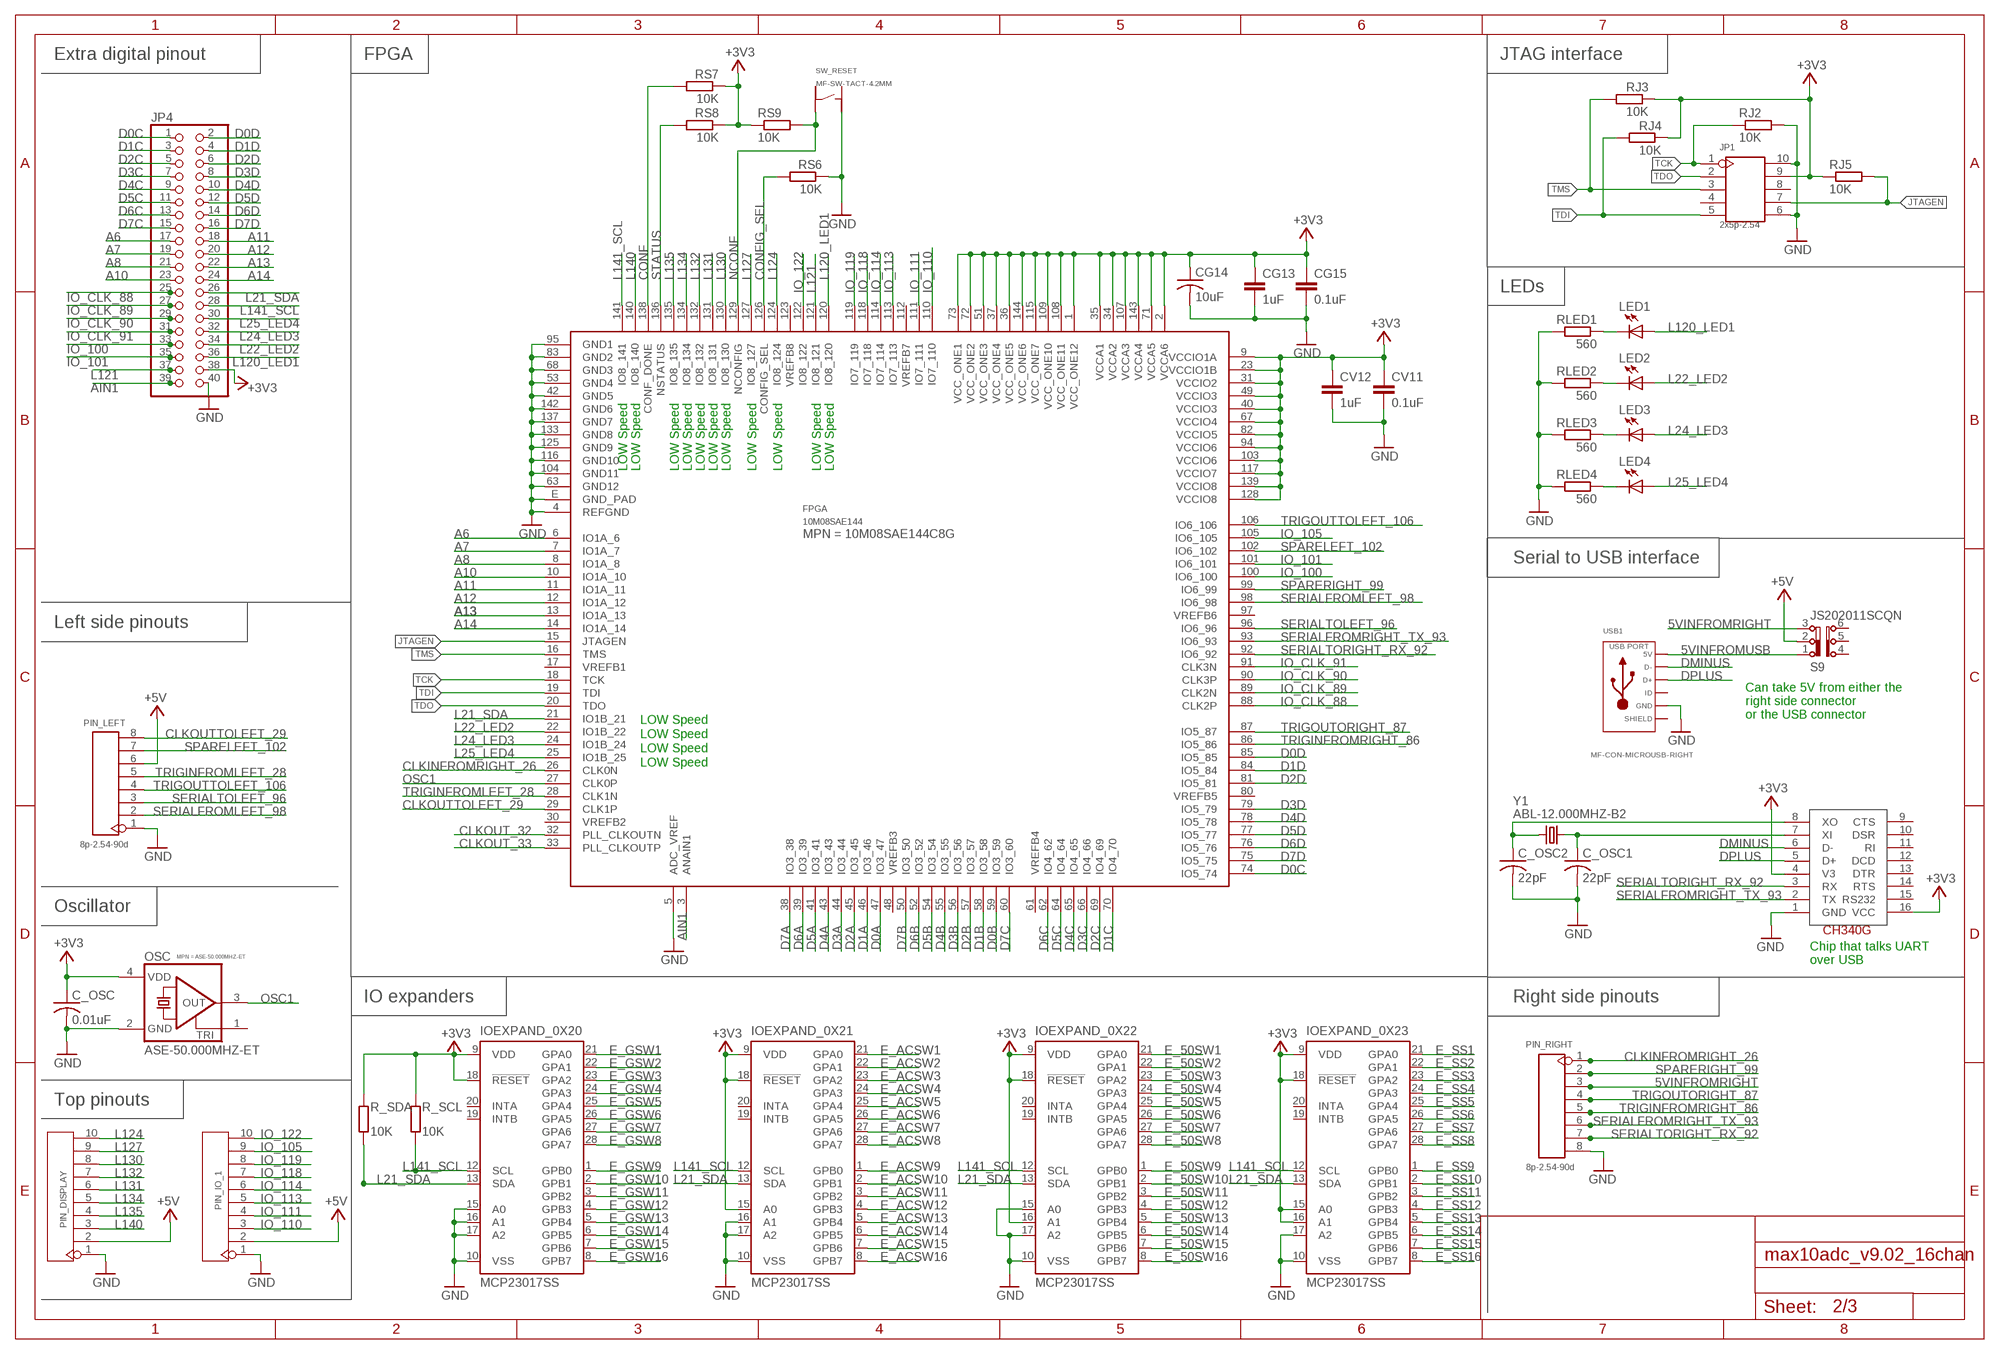
[diagram p3: schematic, sheet 2]

### Parts
C_OSC  0.01uF  C-USC0603  [C0603]
C_OSC1  22pF  C-USC0603  [C0603]
C_OSC2  22pF  C-USC0603  [C0603]
CG13  1uF  C-EUC0805K  [C0805K]
CG14  10uF  C-USC1206  [C1206]
CG15  0.1uF  C-EUC0805K  [C0805K]
CV11  0.1uF  C-EUC0805K  [C0805K]
CV12  1uF  C-EUC0805K  [C0805K]
FPGA  10M08SAE144  [EQFP144]
IOEXPAND_0X20  MCP23017SS  [SSOP28]
IOEXPAND_0X21  MCP23017SS  [SSOP28]
IOEXPAND_0X22  MCP23017SS  [SSOP28]
IOEXPAND_0X23  MCP23017SS  [SSOP28]
JP1  2x5p-2.54  DIP-BLACK-MALE-HEADER(2X5P-2.54)  [H2X5-2.54]
JP4  PINHD-2X20/90  [2X20/90]
LED1  MF-LED-0805-RED  LEDSML0805  [SML0805]
LED2  MF-LED-0805-RED  LEDSML0805  [SML0805]
LED3  MF-LED-0805-RED  LEDSML0805  [SML0805]
LED4  MF-LED-0805-RED  LEDSML0805  [SML0805]
OSC  ASE-50.000MHZ-ET  ASE  [ASE]
PIN_DISPLAY  YELLOW-10P-2.54  DIP-YELLOW-FEMALE-HEADER-VERT(10P-2.54)  [H10-2.54]
PIN_IO_1  YELLOW-10P-2.54  DIP-YELLOW-FEMALE-HEADER-VERT(10P-2.54)  [H10-2.54]
PIN_LEFT  8p-2.54-90d  DIP-BLACK-SHORT-MALE-HEADER-R/A(8P-2.54-90D)  [H8-2.54-90D-MALE]
PIN_RIGHT  8p-2.54-90d  DIP-BLACK-FEMALE-HEADER-R/A(8P-2.54-90D)  [H8-2.54-90D-FEMALE]
R_SCL  10K  R-EU_R0805  [R0805]
R_SDA  10K  R-EU_R0805  [R0805]
RJ2  10K  R-EU_R0805  [R0805]
RJ3  10K  R-EU_R0805  [R0805]
RJ4  10K  R-EU_R0805  [R0805]
RJ5  10K  R-EU_R0805  [R0805]
RLED1  560  R-EU_R0805  [R0805]
RLED2  560  R-EU_R0805  [R0805]
RLED3  560  R-EU_R0805  [R0805]
RLED4  560  R-EU_R0805  [R0805]
RS6  10K  R-EU_R0805  [R0805]
RS7  10K  R-EU_R0805  [R0805]
RS8  10K  R-EU_R0805  [R0805]
RS9  10K  R-EU_R0805  [R0805]
S9  JS202011SCQN  [JS202011SCQN]
SW_RESET  MF-SW-TACT-4.2MM  TACT_4.2MM  [TACT4.2MM]
U340G  CH340G  [SOIC16]
USB1  MF-CON-MICROUSB-RIGHT  USB_5PIN_10118193-0001LF  [10118193-0001LF]
Y1  ABL-12.000MHZ-B2  CRYSTALHC49US  [HC49US]

### Nets
5VINFROMRIGHT [five]: PIN_RIGHT.3 S9.3
5VINFROMUSB [five]: S9.1 USB1.1(5V)
+3V3 [three]: C_OSC.1 CG13.1 CG14.1 CG15.1 CV11.1 CV12.1 FPGA.1(VCC_ONE12) FPGA.2(VCCA6) FPGA.9(VCCIO1A) FPGA.23(VCCIO1B) FPGA.31(VCCIO2) FPGA.34(VCCA2) FPGA.35(VCCA1) FPGA.36(VCC_ONE5) FPGA.37(VCC_ONE4) FPGA.40(VCCIO3) FPGA.49(VCCIO3) FPGA.51(VCC_ONE3) FPGA.67(VCCIO4) FPGA.71(VCCA5) FPGA.72(VCC_ONE2) FPGA.73(VCC_ONE1) FPGA.82(VCCIO5) FPGA.94(VCCIO6) FPGA.103(VCCIO6) FPGA.107(VCCA3) FPGA.108(VCC_ONE11) FPGA.109(VCC_ONE10) FPGA.115(VCC_ONE7) FPGA.117(VCCIO7) FPGA.128(VCCIO8) FPGA.139(VCCIO8) FPGA.143(VCCA4) FPGA.144(VCC_ONE6) IOEXPAND_0X20.9(VDD) IOEXPAND_0X20.18(!RESET) IOEXPAND_0X21.9(VDD) IOEXPAND_0X21.15(A0) IOEXPAND_0X21.18(!RESET) IOEXPAND_0X22.9(VDD) IOEXPAND_0X22.16(A1) IOEXPAND_0X22.18(!RESET) IOEXPAND_0X23.9(VDD) IOEXPAND_0X23.15(A0) IOEXPAND_0X23.16(A1) IOEXPAND_0X23.18(!RESET) JP1.9 JP4.38 OSC.4(VDD) R_SCL.2 R_SDA.2 RJ3.1 RJ4.1 RJ5.1 RS7.1 RS8.1 RS9.1 U340G.4(V3) U340G.16(VCC) ; also sheet 3
+5V [five]: PIN_DISPLAY.2 PIN_IO_1.2 PIN_LEFT.6 S9.2 ; also sheet 3
A6: FPGA.6(IO1A_6) JP4.17
A7: FPGA.7(IO1A_7) JP4.19
A8: FPGA.8(IO1A_8) JP4.21
A10: FPGA.10(IO1A_10) JP4.23
A11: FPGA.11(IO1A_11) JP4.18
A12: FPGA.12(IO1A_12) JP4.20
A13: FPGA.13(IO1A_13) JP4.22
A14: FPGA.14(IO1A_14) JP4.24
AIN1: FPGA.3(ANAIN1) JP4.39 ; also sheet 1
CLKINFROMRIGHT_26: FPGA.26(CLK0N) PIN_RIGHT.1
CLKOUT_32: FPGA.32(PLL_CLKOUTN) ; also sheet 3
CLKOUT_33: FPGA.33(PLL_CLKOUTP) ; also sheet 3
CLKOUTTOLEFT_29: FPGA.29(CLK1P) PIN_LEFT.8
CONF: FPGA.138(CONF_DONE) RS7.2
CONFIG_SEL: FPGA.126(CONFIG_SEL) RS6.2
D0A: FPGA.47(IO3_47) ; also sheet 3
D0B: FPGA.59(IO3_59) ; also sheet 3
D0C: FPGA.74(IO5_74) JP4.1
D0D: FPGA.85(IO5_85) JP4.2
D1A: FPGA.46(IO3_46) ; also sheet 3
D1B: FPGA.58(IO3_58) ; also sheet 3
D1C: FPGA.70(IO4_70) JP4.3
D1D: FPGA.84(IO5_84) JP4.4
D2A: FPGA.45(IO3_45) ; also sheet 3
D2B: FPGA.57(IO3_57) ; also sheet 3
D2C: FPGA.69(IO4_69) JP4.5
D2D: FPGA.81(IO5_81) JP4.6
D3A: FPGA.44(IO3_44) ; also sheet 3
D3B: FPGA.56(IO3_56) ; also sheet 3
D3C: FPGA.66(IO4_66) JP4.7
D3D: FPGA.79(IO5_79) JP4.8
D4A: FPGA.43(IO3_43) ; also sheet 3
D4B: FPGA.55(IO3_55) ; also sheet 3
D4C: FPGA.65(IO4_65) JP4.9
D4D: FPGA.78(IO5_78) JP4.10
D5A: FPGA.41(IO3_41) ; also sheet 3
D5B: FPGA.54(IO3_54) ; also sheet 3
D5C: FPGA.64(IO4_64) JP4.11
D5D: FPGA.77(IO5_77) JP4.12
D6A: FPGA.39(IO3_39) ; also sheet 3
D6B: FPGA.52(IO3_52) ; also sheet 3
D6C: FPGA.62(IO4_62) JP4.13
D6D: FPGA.76(IO5_76) JP4.14
D7A: FPGA.38(IO3_38) ; also sheet 3
D7B: FPGA.50(IO3_50) ; also sheet 3
D7C: FPGA.60(IO3_60) JP4.15
D7D: FPGA.75(IO5_75) JP4.16
DMINUS: U340G.6(D-) USB1.2(D-)
DPLUS: U340G.5(D+) USB1.3(D+)
E_50SW1: IOEXPAND_0X22.21(GPA0) ; also sheet 1
E_50SW2: IOEXPAND_0X22.22(GPA1) ; also sheet 1
E_50SW3: IOEXPAND_0X22.23(GPA2) ; also sheet 1
E_50SW4: IOEXPAND_0X22.24(GPA3) ; also sheet 1
E_50SW5: IOEXPAND_0X22.25(GPA4) ; also sheet 1
E_50SW6: IOEXPAND_0X22.26(GPA5) ; also sheet 1
E_50SW7: IOEXPAND_0X22.27(GPA6) ; also sheet 1
E_50SW8: IOEXPAND_0X22.28(GPA7) ; also sheet 1
E_50SW9: IOEXPAND_0X22.1(GPB0) ; also sheet 1
E_50SW10: IOEXPAND_0X22.2(GPB1) ; also sheet 1
E_50SW11: IOEXPAND_0X22.3(GPB2) ; also sheet 1
E_50SW12: IOEXPAND_0X22.4(GPB3) ; also sheet 1
E_50SW13: IOEXPAND_0X22.5(GPB4) ; also sheet 1
E_50SW14: IOEXPAND_0X22.6(GPB5) ; also sheet 1
E_50SW15: IOEXPAND_0X22.7(GPB6) ; also sheet 1
E_50SW16: IOEXPAND_0X22.8(GPB7) ; also sheet 1
E_ACSW1: IOEXPAND_0X21.21(GPA0) ; also sheet 1
E_ACSW2: IOEXPAND_0X21.22(GPA1) ; also sheet 1
E_ACSW3: IOEXPAND_0X21.23(GPA2) ; also sheet 1
E_ACSW4: IOEXPAND_0X21.24(GPA3) ; also sheet 1
E_ACSW5: IOEXPAND_0X21.25(GPA4) ; also sheet 1
E_ACSW6: IOEXPAND_0X21.26(GPA5) ; also sheet 1
E_ACSW7: IOEXPAND_0X21.27(GPA6) ; also sheet 1
E_ACSW8: IOEXPAND_0X21.28(GPA7) ; also sheet 1
E_ACSW9: IOEXPAND_0X21.1(GPB0) ; also sheet 1
E_ACSW10: IOEXPAND_0X21.2(GPB1) ; also sheet 1
E_ACSW11: IOEXPAND_0X21.3(GPB2) ; also sheet 1
E_ACSW12: IOEXPAND_0X21.4(GPB3) ; also sheet 1
E_ACSW13: IOEXPAND_0X21.5(GPB4) ; also sheet 1
E_ACSW14: IOEXPAND_0X21.6(GPB5) ; also sheet 1
E_ACSW15: IOEXPAND_0X21.7(GPB6) ; also sheet 1
E_ACSW16: IOEXPAND_0X21.8(GPB7) ; also sheet 1
E_GSW1: IOEXPAND_0X20.21(GPA0) ; also sheet 1
E_GSW2: IOEXPAND_0X20.22(GPA1) ; also sheet 1
E_GSW3: IOEXPAND_0X20.23(GPA2) ; also sheet 1
E_GSW4: IOEXPAND_0X20.24(GPA3) ; also sheet 1
E_GSW5: IOEXPAND_0X20.25(GPA4) ; also sheet 1
E_GSW6: IOEXPAND_0X20.26(GPA5) ; also sheet 1
E_GSW7: IOEXPAND_0X20.27(GPA6) ; also sheet 1
E_GSW8: IOEXPAND_0X20.28(GPA7) ; also sheet 1
E_GSW9: IOEXPAND_0X20.1(GPB0) ; also sheet 1
E_GSW10: IOEXPAND_0X20.2(GPB1) ; also sheet 1
E_GSW11: IOEXPAND_0X20.3(GPB2) ; also sheet 1
E_GSW12: IOEXPAND_0X20.4(GPB3) ; also sheet 1
E_GSW13: IOEXPAND_0X20.5(GPB4) ; also sheet 1
E_GSW14: IOEXPAND_0X20.6(GPB5) ; also sheet 1
E_GSW15: IOEXPAND_0X20.7(GPB6) ; also sheet 1
E_GSW16: IOEXPAND_0X20.8(GPB7) ; also sheet 1
E_SS1: IOEXPAND_0X23.21(GPA0) ; also sheet 1
E_SS2: IOEXPAND_0X23.22(GPA1) ; also sheet 1
E_SS3: IOEXPAND_0X23.23(GPA2) ; also sheet 1
E_SS4: IOEXPAND_0X23.24(GPA3) ; also sheet 1
E_SS5: IOEXPAND_0X23.25(GPA4) ; also sheet 1
E_SS6: IOEXPAND_0X23.26(GPA5) ; also sheet 1
E_SS7: IOEXPAND_0X23.27(GPA6) ; also sheet 1
E_SS8: IOEXPAND_0X23.28(GPA7) ; also sheet 1
E_SS9: IOEXPAND_0X23.1(GPB0) ; also sheet 1
E_SS10: IOEXPAND_0X23.2(GPB1) ; also sheet 1
E_SS11: IOEXPAND_0X23.3(GPB2) ; also sheet 1
E_SS12: IOEXPAND_0X23.4(GPB3) ; also sheet 1
E_SS13: IOEXPAND_0X23.5(GPB4) ; also sheet 1
E_SS14: IOEXPAND_0X23.6(GPB5) ; also sheet 1
E_SS15: IOEXPAND_0X23.7(GPB6) ; also sheet 1
E_SS16: IOEXPAND_0X23.8(GPB7) ; also sheet 1
GND [gnd]: C_OSC1.2 C_OSC2.2 C_OSC.2 CG13.2 CG14.2 CG15.2 CV11.2 CV12.2 FPGA.4(REFGND) FPGA.5(ADC_VREF) FPGA.42(GND5) FPGA.53(GND4) FPGA.63(GND12) FPGA.68(GND3) FPGA.83(GND2) FPGA.95(GND1) FPGA.104(GND11) FPGA.116(GND10) FPGA.125(GND9) FPGA.133(GND8) FPGA.137(GND7) FPGA.142(GND6) FPGA.E(GND_PAD) IOEXPAND_0X20.10(VSS) IOEXPAND_0X20.15(A0) IOEXPAND_0X20.16(A1) IOEXPAND_0X20.17(A2) IOEXPAND_0X21.10(VSS) IOEXPAND_0X21.16(A1) IOEXPAND_0X21.17(A2) IOEXPAND_0X22.10(VSS) IOEXPAND_0X22.15(A0) IOEXPAND_0X22.17(A2) IOEXPAND_0X23.10(VSS) IOEXPAND_0X23.17(A2) JP1.6 JP1.10 JP4.40 OSC.2(GND) PIN_DISPLAY.1 PIN_IO_1.1 PIN_LEFT.1 PIN_RIGHT.8 RJ2.2 RLED1.2 RLED2.2 RLED3.2 RLED4.2 RS6.1 SW_RESET.P$2 U340G.1(GND) USB1.5(GND) ; also sheet 1,3
IO_100: FPGA.100(IO6_100) JP4.33 ; also sheet 1
IO_101: FPGA.101(IO6_101) JP4.35 ; also sheet 1
IO_105: FPGA.105(IO6_105) PIN_IO_1.9
IO_110: FPGA.110(IO7_110) PIN_IO_1.3
IO_111: FPGA.111(IO7_111) PIN_IO_1.4
IO_113: FPGA.113(IO7_113) PIN_IO_1.5
IO_114: FPGA.114(IO7_114) PIN_IO_1.6
IO_118: FPGA.118(IO7_118) PIN_IO_1.7
IO_119: FPGA.119(IO7_119) PIN_IO_1.8
IO_122: FPGA.122(IO8_122) PIN_IO_1.10
IO_CLK_88: FPGA.88(CLK2P) JP4.25
IO_CLK_89: FPGA.89(CLK2N) JP4.27
IO_CLK_90: FPGA.90(CLK3P) JP4.29
IO_CLK_91: FPGA.91(CLK3N) JP4.31
JTAGEN: FPGA.15(JTAGEN) JP1.7 RJ5.2
L21_SDA: FPGA.21(IO1B_21) IOEXPAND_0X20.13(SDA) IOEXPAND_0X21.13(SDA) IOEXPAND_0X22.13(SDA) IOEXPAND_0X23.13(SDA) JP4.26 R_SDA.1 ; also sheet 3
L22_LED2: FPGA.22(IO1B_22) JP4.34 LED2.A
L24_LED3: FPGA.24(IO1B_24) JP4.32 LED3.A
L25_LED4: FPGA.25(IO1B_25) JP4.30 LED4.A
L120_LED1: FPGA.120(IO8_120) JP4.36 LED1.A
L121: FPGA.121(IO8_121) JP4.37 ; also sheet 1
L124: FPGA.124(IO8_124) PIN_DISPLAY.10
L127: FPGA.127(IO8_127) PIN_DISPLAY.9
L130: FPGA.130(IO8_130) PIN_DISPLAY.8
L131: FPGA.131(IO8_131) PIN_DISPLAY.6
L132: FPGA.132(IO8_132) PIN_DISPLAY.7
L134: FPGA.134(IO8_134) PIN_DISPLAY.5
L135: FPGA.135(IO8_135) PIN_DISPLAY.4
L140: FPGA.140(IO8_140) PIN_DISPLAY.3
L141_SCL: FPGA.141(IO8_141) IOEXPAND_0X20.12(SCL) IOEXPAND_0X21.12(SCL) IOEXPAND_0X22.12(SCL) IOEXPAND_0X23.12(SCL) JP4.28 R_SCL.1 ; also sheet 3
N$1: LED4.C RLED4.1
N$12: LED3.C RLED3.1
N$13: LED2.C RLED2.1
N$14: LED1.C RLED1.1
N$23: C_OSC1.1 U340G.7(XI) Y1.1
N$31: C_OSC2.1 U340G.8(XO) Y1.2
NCONF: FPGA.129(NCONFIG) RS9.2 SW_RESET.P$4
OSC1: FPGA.27(CLK0P) OSC.3(OUT)
SERIALFROMLEFT_98: FPGA.98(IO6_98) PIN_LEFT.2
SERIALFROMRIGHT_TX_93: FPGA.93(IO6_93) PIN_RIGHT.6 U340G.2(TX)
SERIALTOLEFT_96: FPGA.96(IO6_96) PIN_LEFT.3
SERIALTORIGHT_RX_92: FPGA.92(IO6_92) PIN_RIGHT.7 U340G.3(RX)
SPARELEFT_102: FPGA.102(IO6_102) PIN_LEFT.7
SPARERIGHT_99: FPGA.99(IO6_99) PIN_RIGHT.2
STATUS: FPGA.136(NSTATUS) RS8.2
TCK: FPGA.18(TCK) JP1.1 RJ2.1
TDI: FPGA.19(TDI) JP1.5 RJ4.2
TDO: FPGA.20(TDO) JP1.2
TMS: FPGA.16(TMS) JP1.3 RJ3.2
TRIGINFROMLEFT_28: FPGA.28(CLK1N) PIN_LEFT.5
TRIGINFROMRIGHT_86: FPGA.86(IO5_86) PIN_RIGHT.5
TRIGOUTORIGHT_87: FPGA.87(IO5_87) PIN_RIGHT.4
TRIGOUTTOLEFT_106: FPGA.106(IO6_106) PIN_LEFT.4
Unconnected: FPGA.17(VREFB1) FPGA.30(VREFB2) FPGA.48(VREFB3) FPGA.61(VREFB4) FPGA.80(VREFB5) FPGA.97(VREFB6) FPGA.112(VREFB7) FPGA.123(VREFB8) IOEXPAND_0X20.19(INTB) IOEXPAND_0X20.20(INTA) IOEXPAND_0X21.19(INTB) IOEXPAND_0X21.20(INTA) IOEXPAND_0X22.19(INTB) IOEXPAND_0X22.20(INTA) IOEXPAND_0X23.19(INTB) IOEXPAND_0X23.20(INTA) JP1.4 JP1.8 OSC.1(TRI) S9.4 S9.5 S9.6 SW_RESET.P$1 SW_RESET.P$3 U340G.9(CTS) U340G.10(DSR) U340G.11(RI) U340G.12(DCD) U340G.13(DTR) U340G.14(RTS) U340G.15(RS232) USB1.4(ID)

### Notes on the sheet
- Extra digital pinout | FPGA | JTAG interface
- LEDs
- LOW Speed | LOW Speed | LOW Speed | LOW Speed | LOW Speed | LOW Speed | LOW Speed | LOW Speed | LOW Speed | LOW Speed | LOW Speed
- Serial to USB interface
- Left side pinouts
- Can take 5V from either the
  right side connector
  or the USB connector
- LOW Speed
- LOW Speed
- LOW Speed
- LOW Speed
- Oscillator
- Chip that talks UART
  over USB
- IO expanders | Right side pinouts
- Top pinouts

## Sheet 3 of 3: ADCs & Power
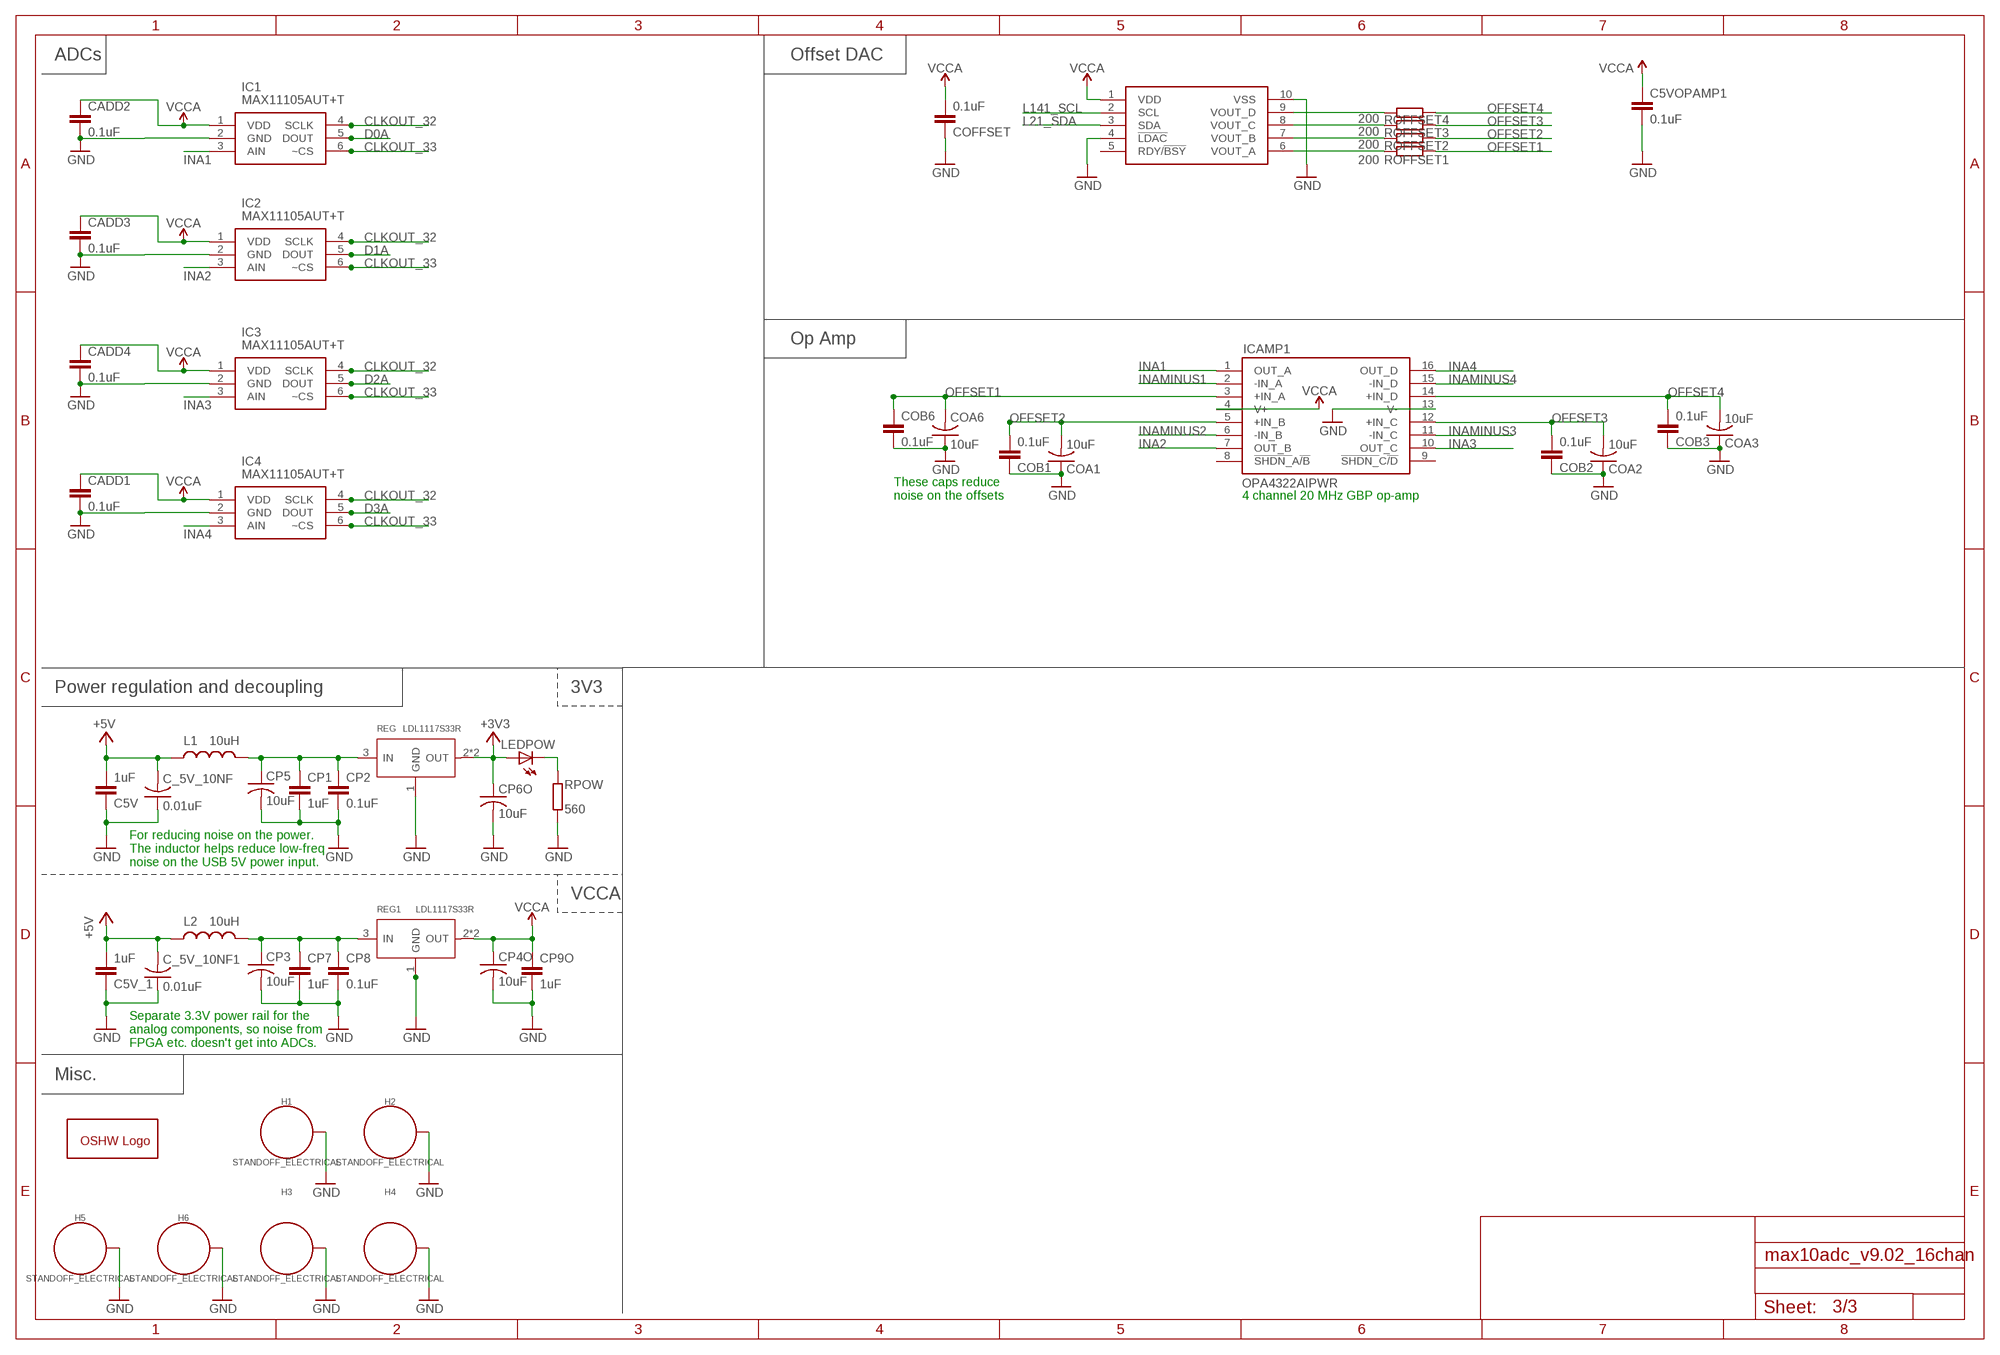
[diagram p4: schematic, sheet 3, part 1 of 2]
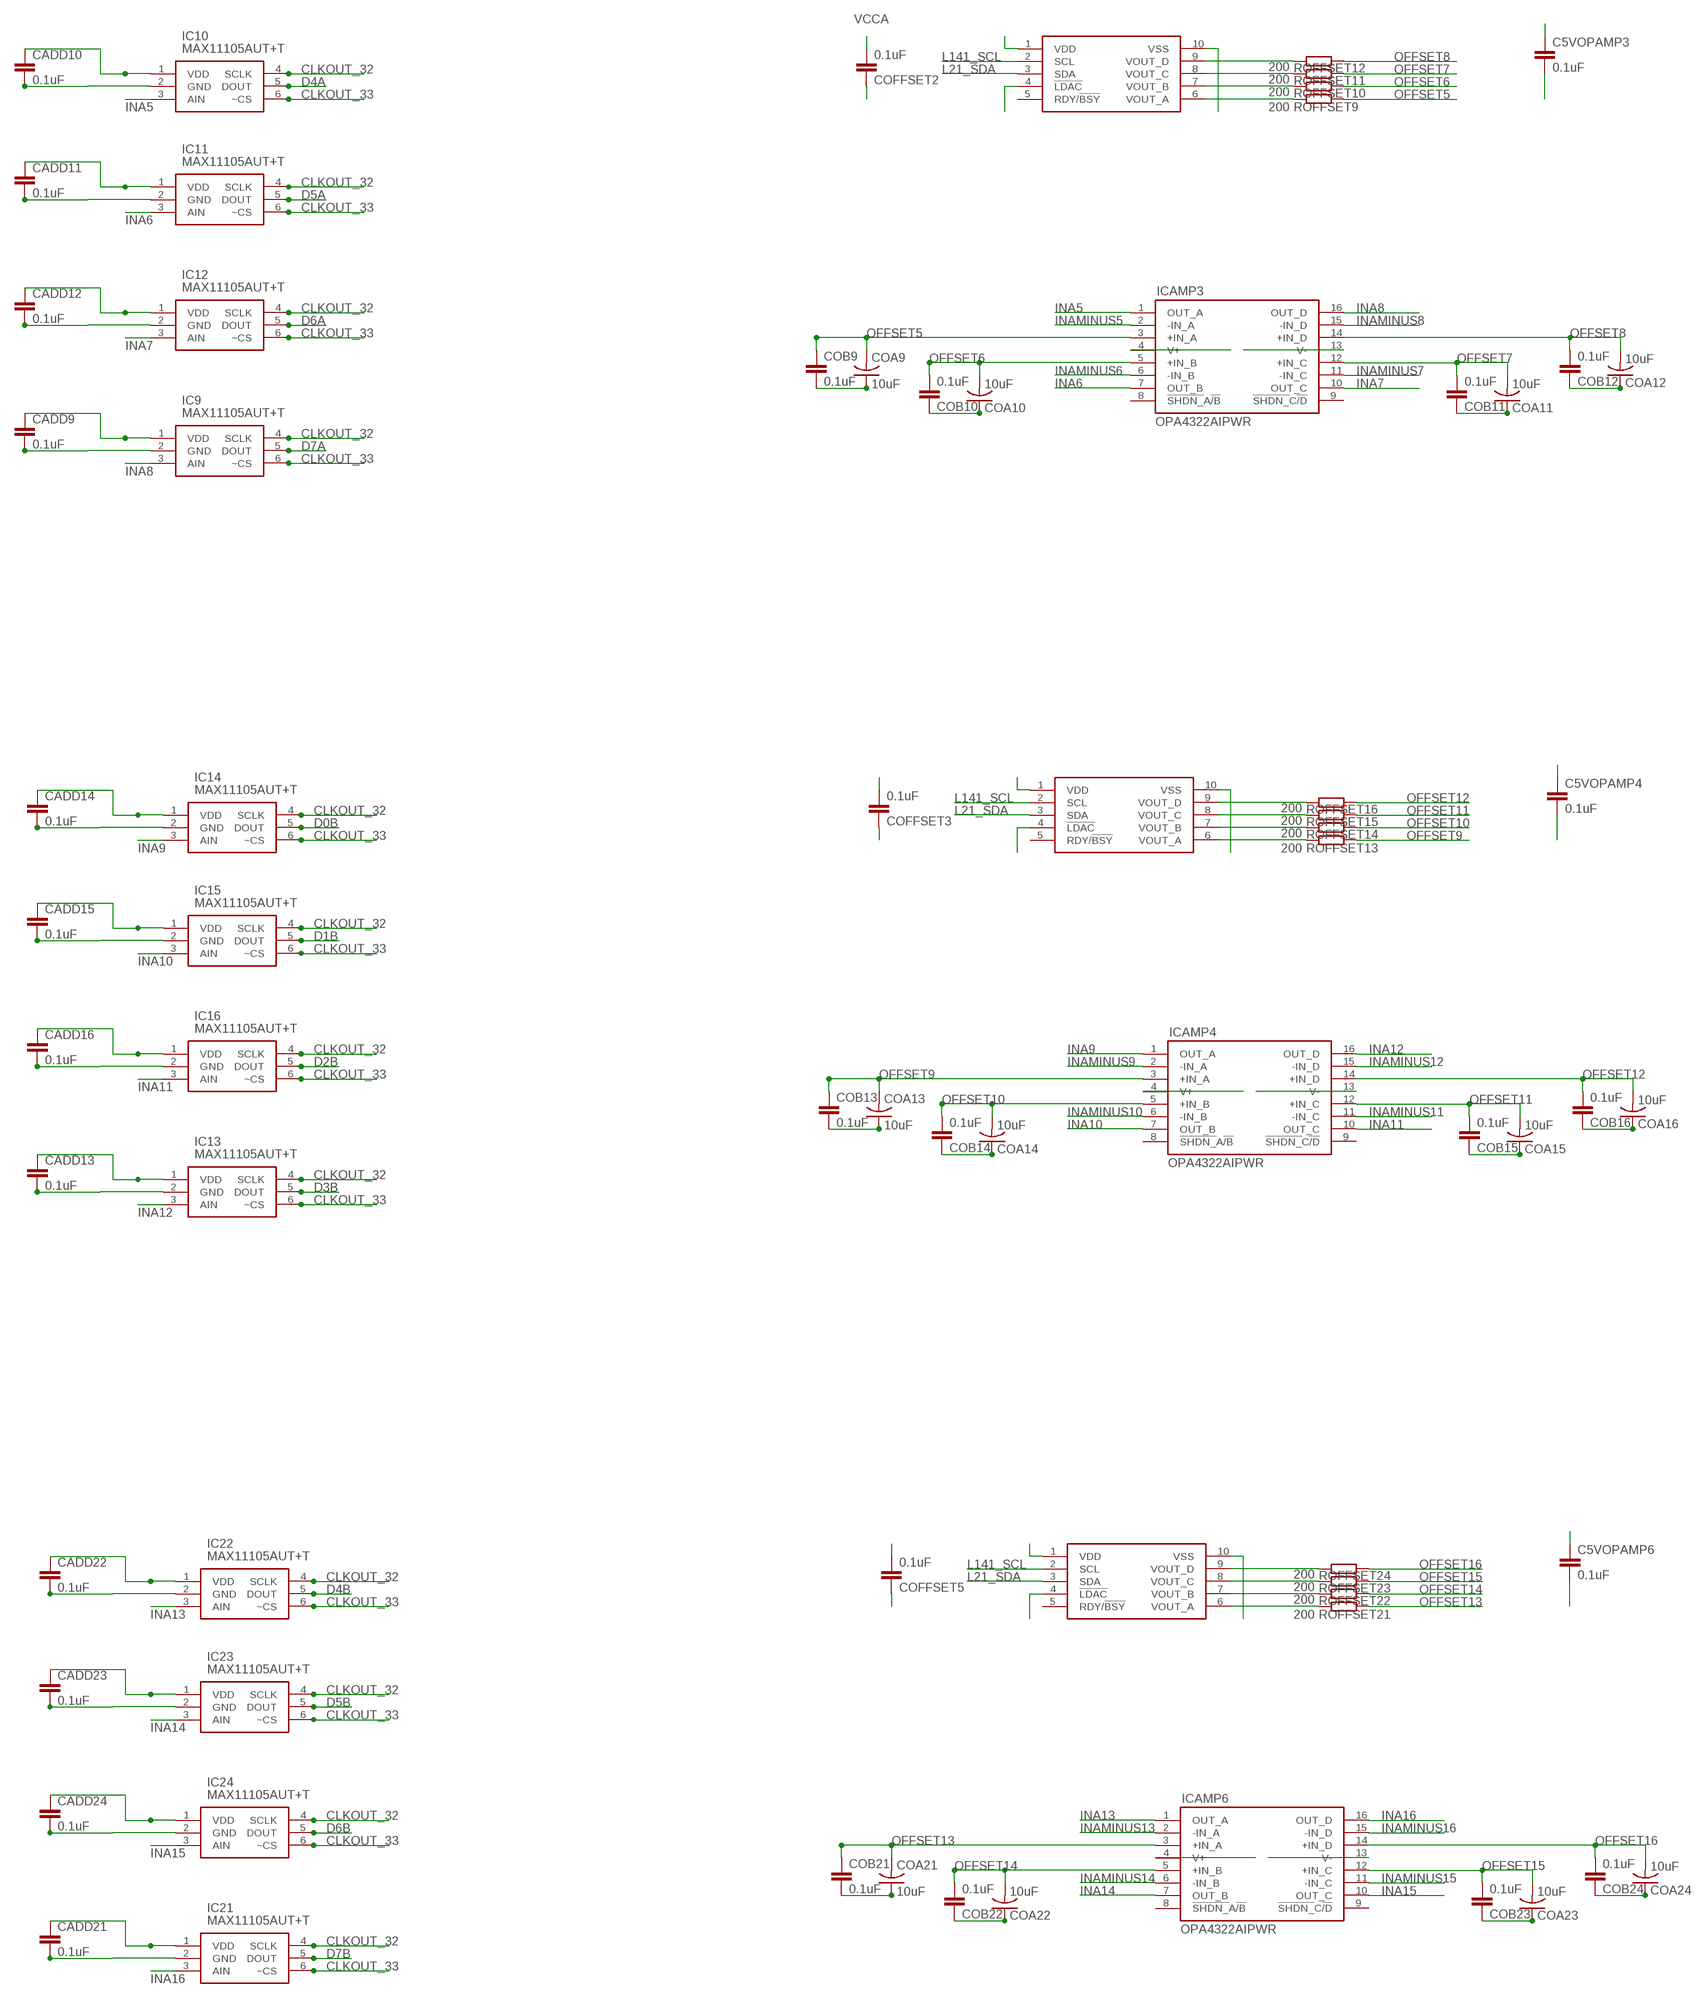
[diagram p5: schematic, sheet 3, part 2 of 2]

### Parts
C5V  1uF  C-EUC0805K  [C0805K]
C5V_1  1uF  C-EUC0805K  [C0805K]
C5VOPAMP1  0.1uF  C-EUC0805K  [C0805K]
C5VOPAMP3  0.1uF  C-EUC0805K  [C0805K]
C5VOPAMP4  0.1uF  C-EUC0805K  [C0805K]
C5VOPAMP6  0.1uF  C-EUC0805K  [C0805K]
C_5V_10NF  0.01uF  C-USC0603  [C0603]
C_5V_10NF1  0.01uF  C-USC0603  [C0603]
CADD1  0.1uF  C-EUC0805K  [C0805K]
CADD2  0.1uF  C-EUC0805K  [C0805K]
CADD3  0.1uF  C-EUC0805K  [C0805K]
CADD4  0.1uF  C-EUC0805K  [C0805K]
CADD9  0.1uF  C-EUC0805K  [C0805K]
CADD10  0.1uF  C-EUC0805K  [C0805K]
CADD11  0.1uF  C-EUC0805K  [C0805K]
CADD12  0.1uF  C-EUC0805K  [C0805K]
CADD13  0.1uF  C-EUC0805K  [C0805K]
CADD14  0.1uF  C-EUC0805K  [C0805K]
CADD15  0.1uF  C-EUC0805K  [C0805K]
CADD16  0.1uF  C-EUC0805K  [C0805K]
CADD21  0.1uF  C-EUC0805K  [C0805K]
CADD22  0.1uF  C-EUC0805K  [C0805K]
CADD23  0.1uF  C-EUC0805K  [C0805K]
CADD24  0.1uF  C-EUC0805K  [C0805K]
COA1  10uF  C-USC1206  [C1206]
COA2  10uF  C-USC1206  [C1206]
COA3  10uF  C-USC1206  [C1206]
COA6  10uF  C-USC1206  [C1206]
COA9  10uF  C-USC1206  [C1206]
COA10  10uF  C-USC1206  [C1206]
COA11  10uF  C-USC1206  [C1206]
COA12  10uF  C-USC1206  [C1206]
COA13  10uF  C-USC1206  [C1206]
COA14  10uF  C-USC1206  [C1206]
COA15  10uF  C-USC1206  [C1206]
COA16  10uF  C-USC1206  [C1206]
COA21  10uF  C-USC1206  [C1206]
COA22  10uF  C-USC1206  [C1206]
COA23  10uF  C-USC1206  [C1206]
COA24  10uF  C-USC1206  [C1206]
COB1  0.1uF  C-EUC0805K  [C0805K]
COB2  0.1uF  C-EUC0805K  [C0805K]
COB3  0.1uF  C-EUC0805K  [C0805K]
COB6  0.1uF  C-EUC0805K  [C0805K]
COB9  0.1uF  C-EUC0805K  [C0805K]
COB10  0.1uF  C-EUC0805K  [C0805K]
COB11  0.1uF  C-EUC0805K  [C0805K]
COB12  0.1uF  C-EUC0805K  [C0805K]
COB13  0.1uF  C-EUC0805K  [C0805K]
COB14  0.1uF  C-EUC0805K  [C0805K]
COB15  0.1uF  C-EUC0805K  [C0805K]
COB16  0.1uF  C-EUC0805K  [C0805K]
COB21  0.1uF  C-EUC0805K  [C0805K]
COB22  0.1uF  C-EUC0805K  [C0805K]
COB23  0.1uF  C-EUC0805K  [C0805K]
COB24  0.1uF  C-EUC0805K  [C0805K]
COFFSET  0.1uF  C-EUC0805K  [C0805K]
COFFSET2  0.1uF  C-EUC0805K  [C0805K]
COFFSET3  0.1uF  C-EUC0805K  [C0805K]
COFFSET5  0.1uF  C-EUC0805K  [C0805K]
CP1  1uF  C-EUC0805K  [C0805K]
CP2  0.1uF  C-EUC0805K  [C0805K]
CP3  10uF  C-USC1206  [C1206]
CP4O  10uF  C-USC1206  [C1206]
CP5  10uF  C-USC1206  [C1206]
CP6O  10uF  C-USC1206  [C1206]
CP7  1uF  C-EUC0805K  [C0805K]
CP8  0.1uF  C-EUC0805K  [C0805K]
CP9O  1uF  C-EUC0805K  [C0805K]
DAC1  MCP4728  [MSOP10]
DAC2  MCP4728  [MSOP10]
DAC3  MCP4728  [MSOP10]
DAC4  MCP4728  [MSOP10]
GOLD_ORB_SM1  OSHWLOGOLOGO8MM  [OSHW_8MM]
H1  STANDOFF_ELECTRICAL  [STANDOFF-ELECTRICAL]
H2  STANDOFF_ELECTRICAL  [STANDOFF-ELECTRICAL]
H3  STANDOFF_ELECTRICAL  [STANDOFF-ELECTRICAL]
H4  STANDOFF_ELECTRICAL  [STANDOFF-ELECTRICAL]
H5  STANDOFF_ELECTRICAL  [STANDOFF-ELECTRICAL]
H6  STANDOFF_ELECTRICAL  [STANDOFF-ELECTRICAL]
IC1  MAX11105AUT+T  [SOT95P280X145-6N]
IC2  MAX11105AUT+T  [SOT95P280X145-6N]
IC3  MAX11105AUT+T  [SOT95P280X145-6N]
IC4  MAX11105AUT+T  [SOT95P280X145-6N]
IC9  MAX11105AUT+T  [SOT95P280X145-6N]
IC10  MAX11105AUT+T  [SOT95P280X145-6N]
IC11  MAX11105AUT+T  [SOT95P280X145-6N]
IC12  MAX11105AUT+T  [SOT95P280X145-6N]
IC13  MAX11105AUT+T  [SOT95P280X145-6N]
IC14  MAX11105AUT+T  [SOT95P280X145-6N]
IC15  MAX11105AUT+T  [SOT95P280X145-6N]
IC16  MAX11105AUT+T  [SOT95P280X145-6N]
IC21  MAX11105AUT+T  [SOT95P280X145-6N]
IC22  MAX11105AUT+T  [SOT95P280X145-6N]
IC23  MAX11105AUT+T  [SOT95P280X145-6N]
IC24  MAX11105AUT+T  [SOT95P280X145-6N]
ICAMP1  OPA4322AIPWR  [SOP65P640X120-16N]
ICAMP3  OPA4322AIPWR  [SOP65P640X120-16N]
ICAMP4  OPA4322AIPWR  [SOP65P640X120-16N]
ICAMP6  OPA4322AIPWR  [SOP65P640X120-16N]
L1  10uH  INDUCTOR1210  [1210]
L2  10uH  INDUCTOR1210  [1210]
LEDPOW  MF-LED-0805-RED  LEDSML0805  [SML0805]
REG  LDL1117S33R  PMIC-CJT1117-3.3(SOT223)  [SOT-223]
REG1  LDL1117S33R  PMIC-CJT1117-3.3(SOT223)  [SOT-223]
ROFFSET1  200  R-EU_R0805  [R0805]
ROFFSET2  200  R-EU_R0805  [R0805]
ROFFSET3  200  R-EU_R0805  [R0805]
ROFFSET4  200  R-EU_R0805  [R0805]
ROFFSET9  200  R-EU_R0805  [R0805]
ROFFSET10  200  R-EU_R0805  [R0805]
ROFFSET11  200  R-EU_R0805  [R0805]
ROFFSET12  200  R-EU_R0805  [R0805]
ROFFSET13  200  R-EU_R0805  [R0805]
ROFFSET14  200  R-EU_R0805  [R0805]
ROFFSET15  200  R-EU_R0805  [R0805]
ROFFSET16  200  R-EU_R0805  [R0805]
ROFFSET21  200  R-EU_R0805  [R0805]
ROFFSET22  200  R-EU_R0805  [R0805]
ROFFSET23  200  R-EU_R0805  [R0805]
ROFFSET24  200  R-EU_R0805  [R0805]
RPOW  560  R-EU_R0805  [R0805]

### Nets
5VC3 [five]: CP3.1 CP7.1 CP8.1 L2.2 REG1.3(IN)
5VC5 [five]: CP1.1 CP2.1 CP5.1 L1.2 REG.3(IN)
+3V3 [three]: CP6O.1 LEDPOW.A REG.2(OUT) REG.TER(OUT) ; also sheet 2
+5V [five]: C5V.2 C5V_1.2 C_5V_10NF1.2 C_5V_10NF.2 L1.1 L2.1 ; also sheet 2
CLKOUT_32: IC1.4(SCLK) IC2.4(SCLK) IC3.4(SCLK) IC4.4(SCLK) IC9.4(SCLK) IC10.4(SCLK) IC11.4(SCLK) IC12.4(SCLK) IC13.4(SCLK) IC14.4(SCLK) IC15.4(SCLK) IC16.4(SCLK) IC21.4(SCLK) IC22.4(SCLK) IC23.4(SCLK) IC24.4(SCLK) ; also sheet 2
CLKOUT_33: IC1.6(~CS) IC2.6(~CS) IC3.6(~CS) IC4.6(~CS) IC9.6(~CS) IC10.6(~CS) IC11.6(~CS) IC12.6(~CS) IC13.6(~CS) IC14.6(~CS) IC15.6(~CS) IC16.6(~CS) IC21.6(~CS) IC22.6(~CS) IC23.6(~CS) IC24.6(~CS) ; also sheet 2
D0A: IC1.5(DOUT) ; also sheet 2
D0B: IC14.5(DOUT) ; also sheet 2
D1A: IC2.5(DOUT) ; also sheet 2
D1B: IC15.5(DOUT) ; also sheet 2
D2A: IC3.5(DOUT) ; also sheet 2
D2B: IC16.5(DOUT) ; also sheet 2
D3A: IC4.5(DOUT) ; also sheet 2
D3B: IC13.5(DOUT) ; also sheet 2
D4A: IC10.5(DOUT) ; also sheet 2
D4B: IC22.5(DOUT) ; also sheet 2
D5A: IC11.5(DOUT) ; also sheet 2
D5B: IC23.5(DOUT) ; also sheet 2
D6A: IC12.5(DOUT) ; also sheet 2
D6B: IC24.5(DOUT) ; also sheet 2
D7A: IC9.5(DOUT) ; also sheet 2
D7B: IC21.5(DOUT) ; also sheet 2
GND [gnd]: C5V.1 C5V_1.1 C5VOPAMP1.2 C5VOPAMP3.2 C5VOPAMP4.2 C5VOPAMP6.2 C_5V_10NF1.1 C_5V_10NF.1 CADD1.2 CADD2.2 CADD3.2 CADD4.2 CADD9.2 CADD10.2 CADD11.2 CADD12.2 CADD13.2 CADD14.2 CADD15.2 CADD16.2 CADD21.2 CADD22.2 CADD23.2 CADD24.2 COA1.1 COA2.1 COA3.1 COA6.1 COA9.1 COA10.1 COA11.1 COA12.1 COA13.1 COA14.1 COA15.1 COA16.1 COA21.1 COA22.1 COA23.1 COA24.1 COB1.1 COB2.1 COB3.1 COB6.1 COB9.1 COB10.1 COB11.1 COB12.1 COB13.1 COB14.1 COB15.1 COB16.1 COB21.1 COB22.1 COB23.1 COB24.1 COFFSET2.1 COFFSET3.1 COFFSET5.1 COFFSET.1 CP1.2 CP2.2 CP3.2 CP4O.2 CP5.2 CP6O.2 CP7.2 CP8.2 CP9O.2 DAC1.4(!LDAC) DAC1.10(VSS) DAC2.4(!LDAC) DAC2.10(VSS) DAC3.4(!LDAC) DAC3.10(VSS) DAC4.4(!LDAC) DAC4.10(VSS) H1.P1 H2.P1 H3.P1 H4.P1 H5.P1 H6.P1 IC1.2(GND) IC2.2(GND) IC3.2(GND) IC4.2(GND) IC9.2(GND) IC10.2(GND) IC11.2(GND) IC12.2(GND) IC13.2(GND) IC14.2(GND) IC15.2(GND) IC16.2(GND) IC21.2(GND) IC22.2(GND) IC23.2(GND) IC24.2(GND) ICAMP1.13(V-) ICAMP3.13(V-) ICAMP4.13(V-) ICAMP6.13(V-) REG1.1(GND) REG.1(GND) RPOW.2 ; also sheet 1,2
INA1: IC1.3(AIN) ICAMP1.1(OUT_A) ; also sheet 1
INA2: IC2.3(AIN) ICAMP1.7(OUT_B) ; also sheet 1
INA3: IC3.3(AIN) ICAMP1.10(OUT_C) ; also sheet 1
INA4: IC4.3(AIN) ICAMP1.16(OUT_D) ; also sheet 1
INA5: IC10.3(AIN) ICAMP3.1(OUT_A) ; also sheet 1
INA6: IC11.3(AIN) ICAMP3.7(OUT_B) ; also sheet 1
INA7: IC12.3(AIN) ICAMP3.10(OUT_C) ; also sheet 1
INA8: IC9.3(AIN) ICAMP3.16(OUT_D) ; also sheet 1
INA9: IC14.3(AIN) ICAMP4.1(OUT_A) ; also sheet 1
INA10: IC15.3(AIN) ICAMP4.7(OUT_B) ; also sheet 1
INA11: IC16.3(AIN) ICAMP4.10(OUT_C) ; also sheet 1
INA12: IC13.3(AIN) ICAMP4.16(OUT_D) ; also sheet 1
INA13: IC22.3(AIN) ICAMP6.1(OUT_A) ; also sheet 1
INA14: IC23.3(AIN) ICAMP6.7(OUT_B) ; also sheet 1
INA15: IC24.3(AIN) ICAMP6.10(OUT_C) ; also sheet 1
INA16: IC21.3(AIN) ICAMP6.16(OUT_D) ; also sheet 1
INAMINUS1: ICAMP1.2(-IN_A) ; also sheet 1
INAMINUS2: ICAMP1.6(-IN_B) ; also sheet 1
INAMINUS3: ICAMP1.11(-IN_C) ; also sheet 1
INAMINUS4: ICAMP1.15(-IN_D) ; also sheet 1
INAMINUS5: ICAMP3.2(-IN_A) ; also sheet 1
INAMINUS6: ICAMP3.6(-IN_B) ; also sheet 1
INAMINUS7: ICAMP3.11(-IN_C) ; also sheet 1
INAMINUS8: ICAMP3.15(-IN_D) ; also sheet 1
INAMINUS9: ICAMP4.2(-IN_A) ; also sheet 1
INAMINUS10: ICAMP4.6(-IN_B) ; also sheet 1
INAMINUS11: ICAMP4.11(-IN_C) ; also sheet 1
INAMINUS12: ICAMP4.15(-IN_D) ; also sheet 1
INAMINUS13: ICAMP6.2(-IN_A) ; also sheet 1
INAMINUS14: ICAMP6.6(-IN_B) ; also sheet 1
INAMINUS15: ICAMP6.11(-IN_C) ; also sheet 1
INAMINUS16: ICAMP6.15(-IN_D) ; also sheet 1
L21_SDA: DAC1.3(SDA) DAC2.3(SDA) DAC3.3(SDA) DAC4.3(SDA) ; also sheet 2
L141_SCL: DAC1.2(SCL) DAC2.2(SCL) DAC3.2(SCL) DAC4.2(SCL) ; also sheet 2
N$15: DAC2.6(VOUT_A) ROFFSET9.2
N$16: DAC2.7(VOUT_B) ROFFSET10.2
N$17: DAC2.8(VOUT_C) ROFFSET11.2
N$19: DAC2.9(VOUT_D) ROFFSET12.2
N$20: DAC3.6(VOUT_A) ROFFSET13.2
N$21: DAC3.7(VOUT_B) ROFFSET14.2
N$22: DAC3.8(VOUT_C) ROFFSET15.2
N$25: DAC3.9(VOUT_D) ROFFSET16.2
N$34: LEDPOW.C RPOW.1
N$41: DAC4.6(VOUT_A) ROFFSET21.2
N$42: DAC4.7(VOUT_B) ROFFSET22.2
N$43: DAC4.8(VOUT_C) ROFFSET23.2
N$44: DAC1.6(VOUT_A) ROFFSET1.2
N$45: DAC1.7(VOUT_B) ROFFSET2.2
N$46: DAC1.8(VOUT_C) ROFFSET3.2
N$47: DAC1.9(VOUT_D) ROFFSET4.2
N$50: DAC4.9(VOUT_D) ROFFSET24.2
OFFSET1: COA6.2 COB6.2 ICAMP1.3(+IN_A) ROFFSET1.1
OFFSET2: COA1.2 COB1.2 ICAMP1.5(+IN_B) ROFFSET2.1
OFFSET3: COA2.2 COB2.2 ICAMP1.12(+IN_C) ROFFSET3.1
OFFSET4: COA3.2 COB3.2 ICAMP1.14(+IN_D) ROFFSET4.1
OFFSET5: COA9.2 COB9.2 ICAMP3.3(+IN_A) ROFFSET9.1
OFFSET6: COA10.2 COB10.2 ICAMP3.5(+IN_B) ROFFSET10.1
OFFSET7: COA11.2 COB11.2 ICAMP3.12(+IN_C) ROFFSET11.1
OFFSET8: COA12.2 COB12.2 ICAMP3.14(+IN_D) ROFFSET12.1
OFFSET9: COA13.2 COB13.2 ICAMP4.3(+IN_A) ROFFSET13.1
OFFSET10: COA14.2 COB14.2 ICAMP4.5(+IN_B) ROFFSET14.1
OFFSET11: COA15.2 COB15.2 ICAMP4.12(+IN_C) ROFFSET15.1
OFFSET12: COA16.2 COB16.2 ICAMP4.14(+IN_D) ROFFSET16.1
OFFSET13: COA21.2 COB21.2 ICAMP6.3(+IN_A) ROFFSET21.1
OFFSET14: COA22.2 COB22.2 ICAMP6.5(+IN_B) ROFFSET22.1
OFFSET15: COA23.2 COB23.2 ICAMP6.12(+IN_C) ROFFSET23.1
OFFSET16: COA24.2 COB24.2 ICAMP6.14(+IN_D) ROFFSET24.1
VCCA [three]: C5VOPAMP1.1 C5VOPAMP3.1 C5VOPAMP4.1 C5VOPAMP6.1 CADD1.1 CADD2.1 CADD3.1 CADD4.1 CADD9.1 CADD10.1 CADD11.1 CADD12.1 CADD13.1 CADD14.1 CADD15.1 CADD16.1 CADD21.1 CADD22.1 CADD23.1 CADD24.1 COFFSET2.2 COFFSET3.2 COFFSET5.2 COFFSET.2 CP4O.1 CP9O.1 DAC1.1(VDD) DAC2.1(VDD) DAC3.1(VDD) DAC4.1(VDD) IC1.1(VDD) IC2.1(VDD) IC3.1(VDD) IC4.1(VDD) IC9.1(VDD) IC10.1(VDD) IC11.1(VDD) IC12.1(VDD) IC13.1(VDD) IC14.1(VDD) IC15.1(VDD) IC16.1(VDD) IC21.1(VDD) IC22.1(VDD) IC23.1(VDD) IC24.1(VDD) ICAMP1.4(V+) ICAMP3.4(V+) ICAMP4.4(V+) ICAMP6.4(V+) REG1.2(OUT) REG1.TER(OUT) ; also sheet 1
Unconnected: DAC1.5(RDY/!BSY) DAC2.5(RDY/!BSY) DAC3.5(RDY/!BSY) DAC4.5(RDY/!BSY) ICAMP1.8(!SHDN_!A!/B) ICAMP1.9(!SHDN_!C!/D) ICAMP3.8(!SHDN_!A!/B) ICAMP3.9(!SHDN_!C!/D) ICAMP4.8(!SHDN_!A!/B) ICAMP4.9(!SHDN_!C!/D) ICAMP6.8(!SHDN_!A!/B) ICAMP6.9(!SHDN_!C!/D)

### Notes on the sheet
- ADCs | Offset DAC
- Op Amp
- These caps reduce 
  noise on the offsets
- 4 channel 20 MHz GBP op-amp
- Power regulation and decoupling | 3V3
- For reducing noise on the power.
  The inductor helps reduce low-freq
  noise on the USB 5V power input.
- VCCA
- Separate 3.3V power rail for the
  analog components, so noise from
  FPGA etc. doesn't get into ADCs.
- Misc.

## Power pins joined to a net without a drawn wire
SLD: USB1.S1(SLD) USB1.S2(SLD) USB1.S3(SLD) USB1.S4(SLD)

## Library data of the parts
ACR1-ACR4 ACR9-ACR16 ACR21-ACR24 RLED1-RLED4 RPOW = resistor:R-EU_: RESISTOR, European symbol; MPN: MF-RES-0805-560; OC_NEWARK: unknown
C5V C5V_1 CG13 CP1 CP7 CP9O CV12 = rcl:C-EU: CAPACITOR, European symbol; MPN: MF-CAP-0805-1uF
C5VOPAMP1 C5VOPAMP3 C5VOPAMP4 C5VOPAMP6 CADD1-CADD4 CADD9-CADD16 CADD21-CADD24 CG15 COB1-COB3 COB6 COB9-COB16 COB21-COB24 COFFSET COFFSET2 COFFSET3 COFFSET5 CP2 CP8 CV11 = rcl:C-EU: CAPACITOR, European symbol; MPN: MF-CAP-0805-0.1uF
C_5V_10NF C_5V_10NF1 C_OSC CAC1 CAC3 CAC5 CAC6 CAC9-CAC16 CAC21-CAC24 = rcl@1:C-US: CAPACITOR, American symbol; MFN: MF-CAP-0603-0.01uF
C_OSC1 C_OSC2 = rcl@1:C-US: CAPACITOR, American symbol; MFN: MF-CAP-0603-22pF
CG14 COA1-COA3 COA6 COA9-COA16 COA21-COA24 CP3 CP4O CP5 CP6O = rcl@1:C-US: CAPACITOR, American symbol; MPN: MF-CAP-1206-10uF
CGAIN1_1 CGAIN1_3 CGAIN1_5 CGAIN1_6 CGAIN1_9-CGAIN1_16 CGAIN1_21-CGAIN1_24 CGN1-CGN32 = rcl@1:C-US: CAPACITOR, American symbol
CIN1 CIN3 CIN5 CIN6 CIN9-CIN16 CIN21-CIN24 = rcl@1:C-US: CAPACITOR, American symbol; MPN: MF-CAP-0603-10pF
CIN56S1 CIN56S3 CIN56S5 CIN56S6 CIN56S9-CIN56S16 CIN56S21-CIN56S24 = rcl@1:C-US: CAPACITOR, American symbol; MPN: 06035A560FAT2A
CINS1 CINS3 CINS5 CINS6 CINS9-CINS16 CINS21-CINS24 = rcl@1:C-US: CAPACITOR, American symbol; MPN: 06035A102JAT2A
DAC1-DAC4 = Luca Eagle-Library:MCP4728; MFN: MCP4728-E/UN
FPGA = 10M08SAE144:10M08SAE144; MPN: 10M08SAE144C8G; OC_NEWARK: unknown
GOLD_ORB_SM1 = oshw:OSHWLOGO: The OSHW logo for PCB layout
GSW1 GSW3 GSW5 GSW6 GSW9-GSW16 GSW21-GSW24 = 74xx-little-us:74*1G3157: Single-Pole, Double-Throw Analog Switch Source: http://focus.ti.com/lit/ds/symlink/sn74lvc1g3157.pdf; MPN: SN74LVC1G3157DBV
H1-H6 = SparkFun-Hardware:STANDOFF_ELECTRICAL: Stand Off Drill holes with an electrical connection. For example, use these to ground your board to a chassis. Example SparkFun Products Screw - Phillips Head (1/4", 4-40, 10 pack) <https://www.sparkfun.com/products/10453> (PRT-10453) Screw - Phillips Head (1/2", 4-40, 10 pack) <https://www.sparkfun.com/products/10452> (PRT-10452) Screw - Phillips Head (3/4", 4-40, 10 pack) <https://www.sparkfun.com/products/10451> (PRT-10451) Screw - Phillips Head (1", 4-40, 10 pack) <https://www.sparkfun.com/products/10450> (PRT-10450)
IC1-IC4 IC9-IC16 IC21-IC24 = SamacSys_Parts:MAX11105AUT+T: ADC Source: Datasheet <https://componentsearchengine.com/Datasheets/1/MAX11105AUT T.pdf>; DESCRIPTION: ADC; HEIGHT: mm; MANUFACTURER_NAME: Maxim Integrated; MANUFACTURER_PART_NUMBER: MAX11105AUT+T; MOUSER_PART_NUMBER: 700-MAX11105AUT+T; MOUSER_PRICE-STOCK: https://www.mouser.com/Search/Refine.aspx?Keyword=700-MAX11105AUT%2BT
ICAMP1 ICAMP3 ICAMP4 ICAMP6 = SamacSys_Parts:OPA4322AIPWR: 20MHz, Low Noise, 1.8V, RRIO, CMOS Operational Amplifier Source: Datasheet <http://www.ti.com/lit/ds/symlink/opa4322.pdf>; DESCRIPTION: 20MHz, Low Noise, 1.8V, RRIO, CMOS Operational Amplifier; HEIGHT: 1.2mm; MANUFACTURER_NAME: Texas Instruments; MANUFACTURER_PART_NUMBER: OPA4322AIPWR; MOUSER_PART_NUMBER: 595-OPA4322AIPWR; MOUSER_PRICE-STOCK: https://www.mouser.com/Search/Refine.aspx?Keyword=595-OPA4322AIPWR
IOEXPAND_0X20-IOEXPAND_0X23 = microchip:MCP23017: http://ww1.microchip.com/downloads/en/DeviceDoc/21952a.pdf Source: http://ww1.microchip.com/downloads/en/DeviceDoc/21952a.pdf; MF: MICROCHIP; MPN: MCP23017-E/SS; OC_FARNELL: 1467674; OC_NEWARK: 31K2960
JP1 = Seeed-OPL-Connector:DIP-BLACK-MALE-HEADER(2X5P-2.54): 320020122
JP2-JP4 = pinhead:PINHD-2X20: PIN HEADER
K1 K3 K5 K6 K9-K16 K21-K24 = relay:AQY*: PhotoMOS Relay NAiS Source: http://www.panasonic-electric-works.com/catalogues/downloads/photomos/ds_x615_en_aqz10_20.pdf; MPN: AQY210S; OC_FARNELL: unknown; OC_NEWARK: unknown
L1 L2 = SparkFun-Passives:INDUCTOR: Inductors Basic Inductor/Choke - 0603 and 1206. Footprints are not proven and vary greatly between part numbers. INDUCTOR POWER 3.3UH 4.0A SMD 0.197" L x 0.197" W x 0.177" H (5.00mm x 5.00mm x 4.50mm); MPN: MF-IND-1210-10uH
LED1-LED4 LEDPOW = led:LED: LED OSRAM: - CHIPLED LG R971, LG N971, LY N971, LG Q971, LY Q971, LO R971, LY R971 LH N974, LH R974 LS Q976, LO Q976, LY Q976 LO Q996 - Hyper CHIPLED LW Q18S LB Q993, LB Q99A, LB R99A - SideLED LS A670, LO A670, LY A670, LG A670, LP A670 LB A673, LV A673, LT A673, LW A673 LH A674 LY A675 LS A676, LA A676, LO A676, LY A676, LW A676 LS A679, LY A679, LG A679 - Hyper Micro SIDELED® LS Y876, LA Y876, LO Y876, LY Y876 LT Y87S - SmartLED LW L88C, LW L88S LB L89C, LB L89S, LG L890 LS L89K, LO L89K, LY L89K LS L896, LA L896, LO L896, LY L896 - TOPLED LS T670, LO T670, LY T670, LG T670, LP T670 LSG T670, LSP T670, LSY T670, LOP T670, LYG T670 LG T671, LOG T671, LSG T671 LB T673, LV T673, LT T673, LW T673 LH T674 LS T676, LA T676, LO T676, LY T676, LB T676, LH T676, LSB T676, LW T676 LB T67C, LV T67C, LT T67C, LS T67K, LO T67K, LY T67K, LW E67C LS E67B, LA E67B, LO E67B, LY E67B, LB E67C, LV E67C, LT E67C LW T67C LS T679, LY T679, LG T679 LS T770, LO T770, LY T770, LG T770, LP T770 LB T773, LV T773, LT T773, LW T773 LH T774 LS E675, LA E675, LY E675, LS T675 LS T776, LA T776, LO T776, LY T776, LB T776 LHGB T686 LT T68C, LB T68C - Hyper Mini TOPLED® LB M676 - Mini TOPLED Santana® LG M470 LS M47K, LO M47K, LY M47K Source: http://www.osram.convergy.de LUXEON: - LUMILED® LXK2-PW12-R00, LXK2-PW12-S00, LXK2-PW14-U00, LXK2-PW14-V00 LXK2-PM12-R00, LXK2-PM12-S00, LXK2-PM14-U00 LXK2-PE12-Q00, LXK2-PE12-R00, LXK2-PE12-S00, LXK2-PE14-T00, LXK2-PE14-U00 LXK2-PB12-K00, LXK2-PB12-L00, LXK2-PB12-M00, LXK2-PB14-N00, LXK2-PB14-P00, LXK2-PB14-Q00 LXK2-PR12-L00, LXK2-PR12-M00, LXK2-PR14-Q00, LXK2-PR14-R00 LXK2-PD12-Q00, LXK2-PD12-R00, LXK2-PD12-S00 LXK2-PH12-R00, LXK2-PH12-S00 LXK2-PL12-P00, LXK2-PL12-Q00, LXK2-PL12-R00 Source: www.luxeon.com KINGBRIGHT: KA-3528ASYC Source: www.kingbright.com; MPN: MF-LED-0805-RED; OC_NEWARK: unknown
OSC = crystal:ASE: 3.3Vdc CMOS SMD CRYSTAL CLOCK OSCILLATOR SOurce: www.abracon.com; MPN: ASE-50.000MHZ-ET; OC_FARNELL: unknown; OC_NEWARK: unknown
PIN_DISPLAY PIN_IO_1 = Seeed-Connector:DIP-YELLOW-FEMALE-HEADER-VERT(10P-2.54): 320030059
PIN_LEFT = Seeed-OPL-Connector:DIP-BLACK-SHORT-MALE-HEADER-R/A(8P-2.54-90D): 320020026
PIN_RIGHT = Seeed-OPL-Connector:DIP-BLACK-FEMALE-HEADER-R/A(8P-2.54-90D): 320030076
R_SCL R_SDA = resistor:R-EU_: RESISTOR, European symbol; MPN: MF-RES-0805-10K; OC_NEWARK: unknown
REG REG1 = Seeed-IC-2016:PMIC-CJT1117-3.3(SOT223): 310030097; MPN: LDL1117S33R; VALUE: CJT1117-3.3-SOT223
RG1_1 RG1_3 RG1_5-RG1_8 RG1_11 RG1_12 RG2_1 RG2_3 RG2_5-RG2_8 RG2_11 RG2_12 RG3_3-RG3_8 RG3_11 RG3_12 RG4_3-RG4_8 RG4_11 RG4_12 = resistor:R-EU_: RESISTOR, European symbol; OC_NEWARK: unknown
RIN1 RIN3 RIN5 RIN6 RIN9-RIN16 RIN21-RIN24 = resistor:R-EU_: RESISTOR, European symbol; MPN: CRCW08051M10FKEA; OC_NEWARK: unknown
RIN10M1 RIN10M3 RIN10M5 RIN10M6 RIN10M9-RIN10M16 RIN10M21-RIN10M24 = resistor:R-EU_: RESISTOR, European symbol; MPN: CRCW080510M0FKEB; OC_NEWARK: unknown
RINS1 RINS3 RINS5 RINS6 RINS9-RINS16 RINS21-RINS24 = resistor:R-EU_: RESISTOR, European symbol; MPN: CRCW080511K0FKEA; OC_NEWARK: 05M4535
RJ2-RJ5 RS6-RS9 = resistor:R-EU_: RESISTOR, European symbol; MPN: MF-RES-0805-10K; OC_NEWARK: 05M4535
ROFFSET1-ROFFSET4 ROFFSET9-ROFFSET16 ROFFSET21-ROFFSET24 = resistor:R-EU_: RESISTOR, European symbol
S2 S6 S9 S11 S13 S19 S21 S23 S25 S27 S29 S31 S33 S43 S45 S47 S49 = switch-ck:JS202011SCQN: DPDT SLIDE SWITCH
SW_RESET = MF_Switches:TACT: Library: MF_Switches Description: Device for Tact Switches. Manufacture part number (MFG#) can be added via Attributes.; HOUSEPART: YES; MPN: MF-SW-TACT-4.2MM; POPULATE: 1; URL: https://factory.macrofab.com/part/MF-SW-TACT-4.2MM
U340G = usb-serial:CH340G
USB1 = PP_Connectors:USB_5PIN; POPULATE: 1
Y1 = SparkFun-FreqCtrl:CRYSTAL: Various standard crystals. Proven footprints.

## Net classes
0 default: width 0.152 mm
1 gnd: width 0.305 mm
2 three: width 0.305 mm
3 five: width 0.381 mm